# Altium project RIO_rev0.PrjPcb
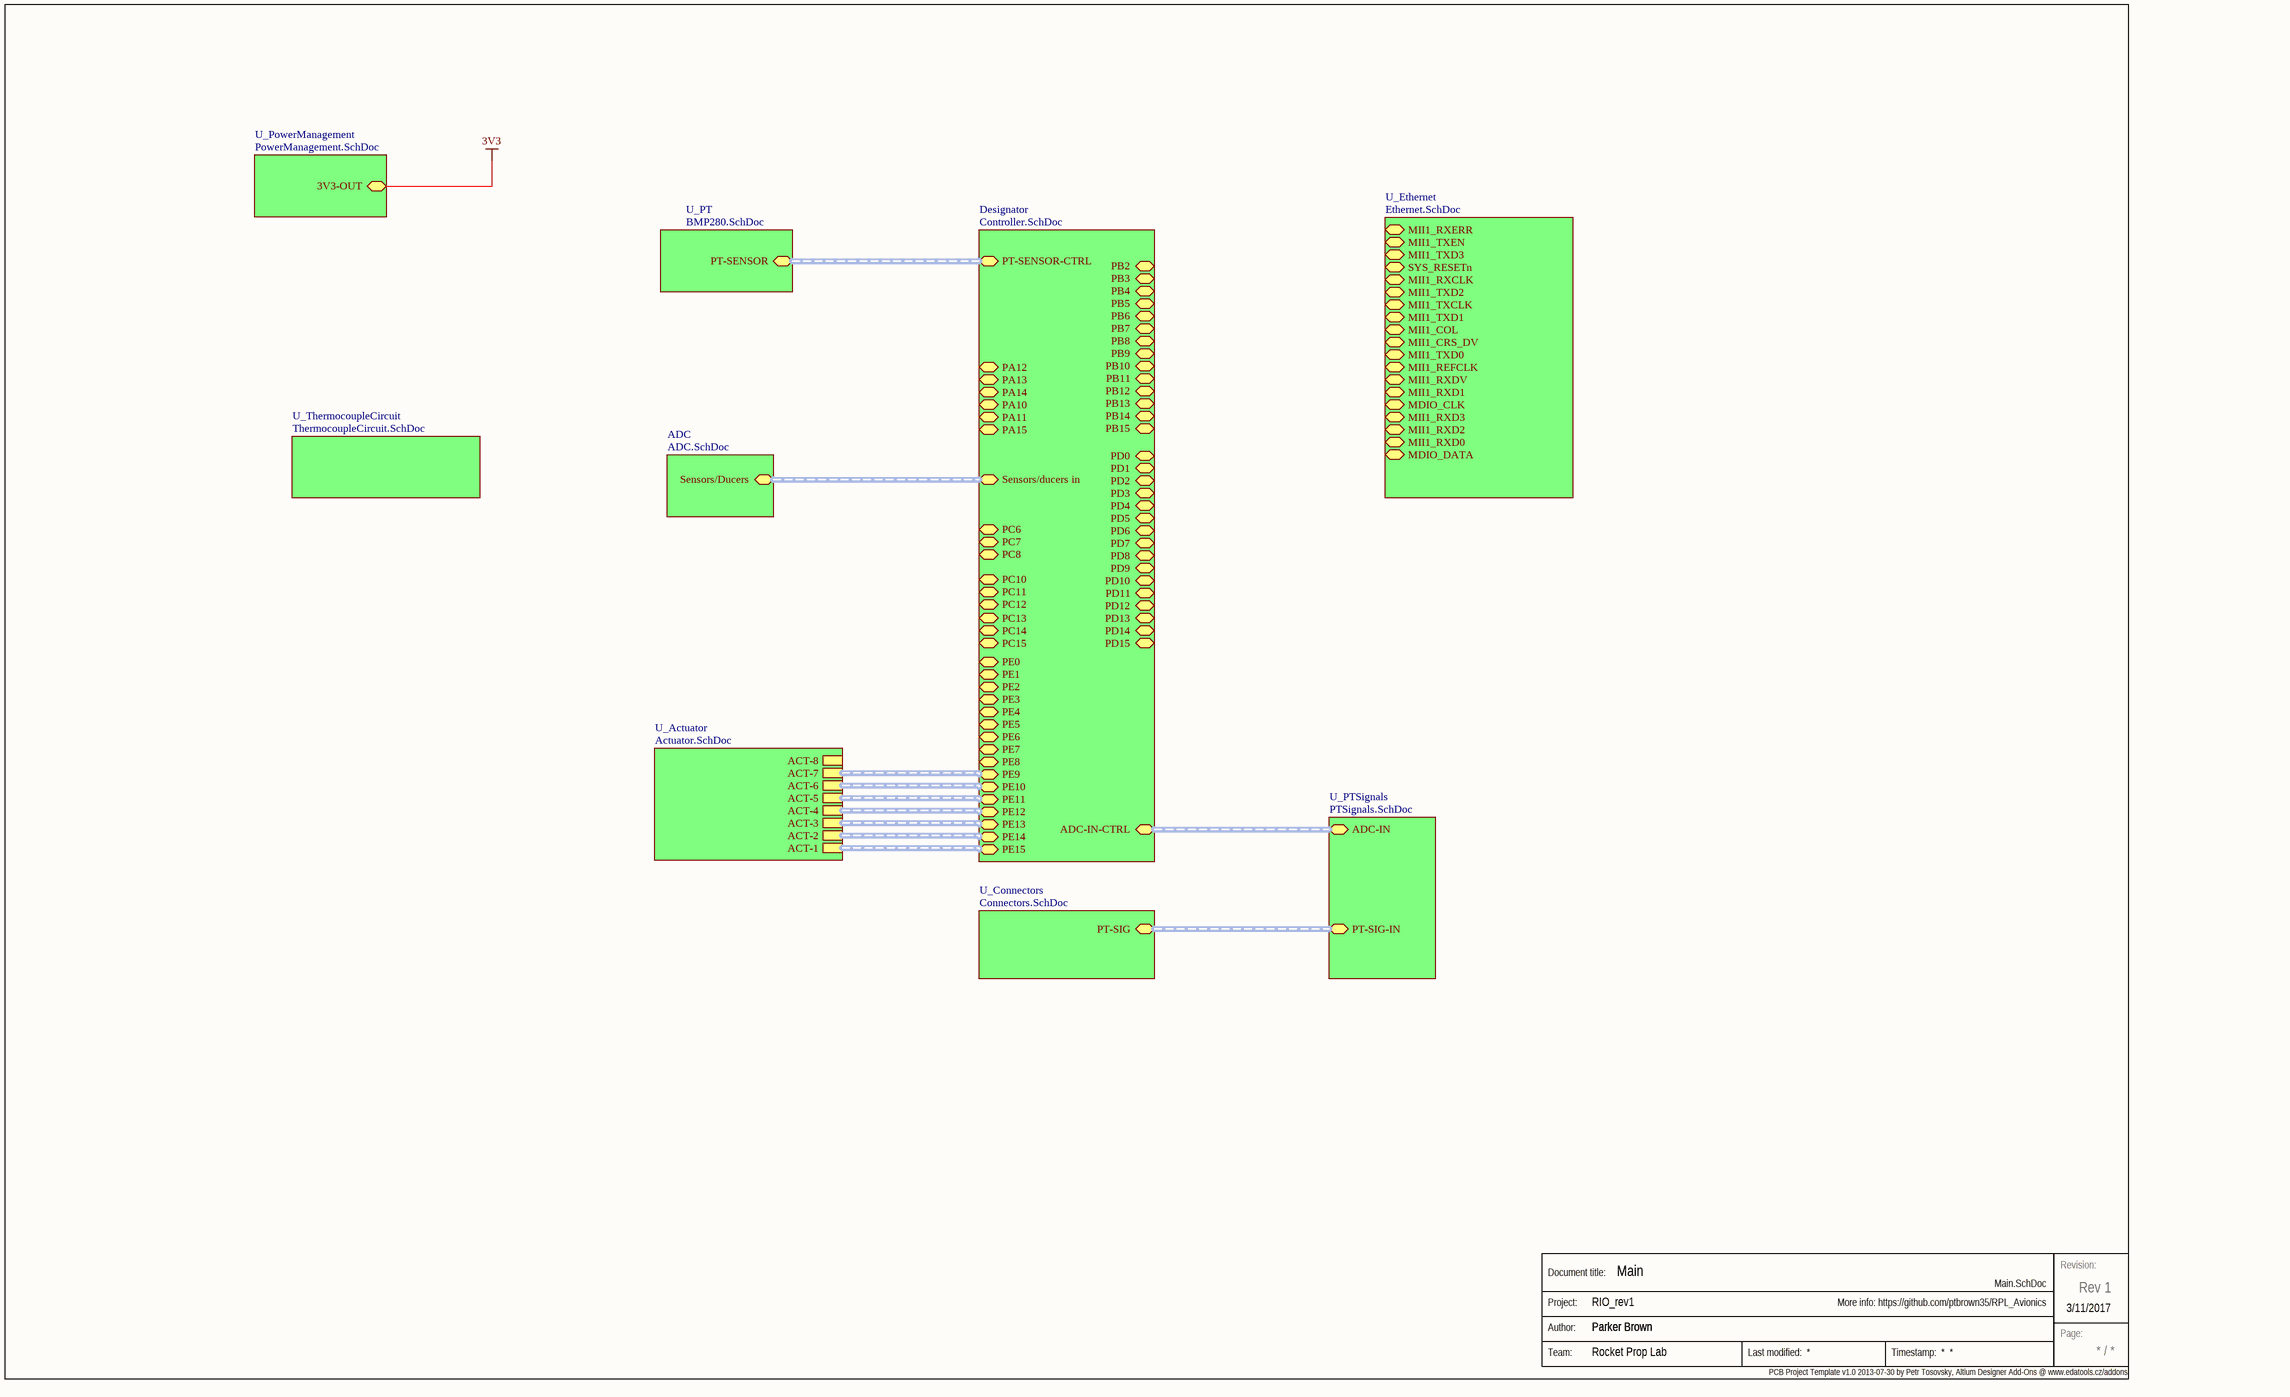
[diagram p0: Main.SchDoc]
GlobalProjectLink: https://github.com/ptbrown35/RPL_Avionics; GlobalProjectName: RIO_rev1; GlobalProjectRevision: Rev 1; GlobalProjectTeam: Rocket Prop Lab; GlobalRevisionDate: 3/11/2017
9 sheets, 86 parts. Net scope: hierarchical (ports join the sheet entries above them; power ports are global).
Board file: RIO_rev0.PcbDoc
Sheets:
  Main.SchDoc
    Designator = Controller.SchDoc
    U_Ethernet = Ethernet.SchDoc
    U_Connectors = Connectors.SchDoc
      J-PT1 = AnalogConnectors.SchDoc
      J-PT2 = AnalogConnectors.SchDoc
      J-PT3 = AnalogConnectors.SchDoc
      J-PT4 = AnalogConnectors.SchDoc
      J-PT5 = AnalogConnectors.SchDoc
      J-PT6 = AnalogConnectors.SchDoc
      J-PT7 = AnalogConnectors.SchDoc
      J-PT8 = AnalogConnectors.SchDoc
    U_PowerManagement = PowerManagement.SchDoc
    U_PTSignals = PTSignals.SchDoc
    U_ThermocoupleCircuit = ThermocoupleCircuit.SchDoc
    U_Actuator = Actuator.SchDoc

## Sheet Main.SchDoc: Main
size Tabloid; Author: Parker Brown

### Parts
(Parts that share a designator on the sheet are numbered #1, #2 ... from top to bottom, then left to right.)
Stamp#1  Stamp  (value not drawn)  (graphical)

### Sub-sheets
ADC = ADC.SchDoc (file not in this document): Sensors/Ducers (harness ADC to micro)
Designator = Controller.SchDoc: PA12, PA13, PA14, PA10, PA11, PA15, PC6, PC7, PC8, PC13, PC14, PC15, PC11, PC12, PC10, PE0, PE1, PE2, PE3, PE4, PE5, PE6, PE7, PE8, PE9, PE10, PE11, PE12, PE13, PE14, PE15, PB2, PB3, PB4, PB5, PB6, PB7, PB8, PB9, PB10, PB11, PB12, PB13, PB14, PB15, PD0, PD1, PD2, PD3, PD4, PD5, PD6, PD7, PD8, PD9, PD10, PD11, PD12, PD13, PD14, PD15, ADC-IN-CTRL (harness ADC), PT-SENSOR-CTRL (harness PT-SENSOR), Sensors/ducers in (harness ADC)
U_Actuator = Actuator.SchDoc: ACT-8 (harness ACT), ACT-7 (harness ACT), ACT-6 (harness ACT), ACT-5 (harness ACT), ACT-4 (harness ACT), ACT-3 (harness ACT), ACT-2 (harness ACT), ACT-1 (harness ACT)
U_Connectors = Connectors.SchDoc: PT-SIG (harness PT-SIGNALS)
U_Ethernet = Ethernet.SchDoc: MII1_RXERR, MII1_TXEN, MII1_TXD3, SYS_RESETn, MII1_RXCLK, MII1_TXD2, MII1_TXCLK, MII1_TXD1, MII1_COL, MII1_CRS_DV, MII1_TXD0, MII1_REFCLK, MII1_RXDV, MII1_RXD1, MDIO_CLK, MII1_RXD3, MII1_RXD2, MII1_RXD0, MDIO_DATA
U_PowerManagement = PowerManagement.SchDoc: 3V3-OUT
U_PT = BMP280.SchDoc (file not in this document): PT-SENSOR (harness PT-SENSOR)
U_PTSignals = PTSignals.SchDoc: PT-SIG-IN (harness PT-SIGNALS), ADC-IN (harness ADC)
U_ThermocoupleCircuit = ThermocoupleCircuit.SchDoc: no entries

### Buses and harness runs
harness sheet ADC/Sensors/Ducers = sheet Designator/Sensors/ducers in
harness sheet Designator/ADC-IN-CTRL = sheet U_PTSignals/ADC-IN
harness sheet Designator/PE9 = sheet U_Actuator/ACT-7
harness sheet Designator/PE10 = sheet U_Actuator/ACT-6
harness sheet Designator/PE11 = sheet U_Actuator/ACT-5
harness sheet Designator/PE12 = sheet U_Actuator/ACT-4
harness sheet Designator/PE13 = sheet U_Actuator/ACT-3
harness sheet Designator/PE14 = sheet U_Actuator/ACT-2
harness sheet Designator/PE15 = sheet U_Actuator/ACT-1
harness sheet Designator/PT-SENSOR-CTRL = sheet U_PT/PT-SENSOR
harness sheet U_Connectors/PT-SIG = sheet U_PTSignals/PT-SIG-IN

### Notes on the sheet
- PCB Project Template v1.0 2013-07-30 by Petr Tosovsky, Altium Designer Add-Ons @ www.edatools.cz/addons <http://www.edatools.cz/addons>
- Labels drawn without touching a wire or pin: 3V3
- (in symbol Stamp) Revision:; Document title:; Project:; Author:; Page:; Team:

## Sheet Controller.SchDoc: Set in Document Options » Parameters » Title
size Tabloid; Author: Set in Document Options » Parameters » Author + Contact info
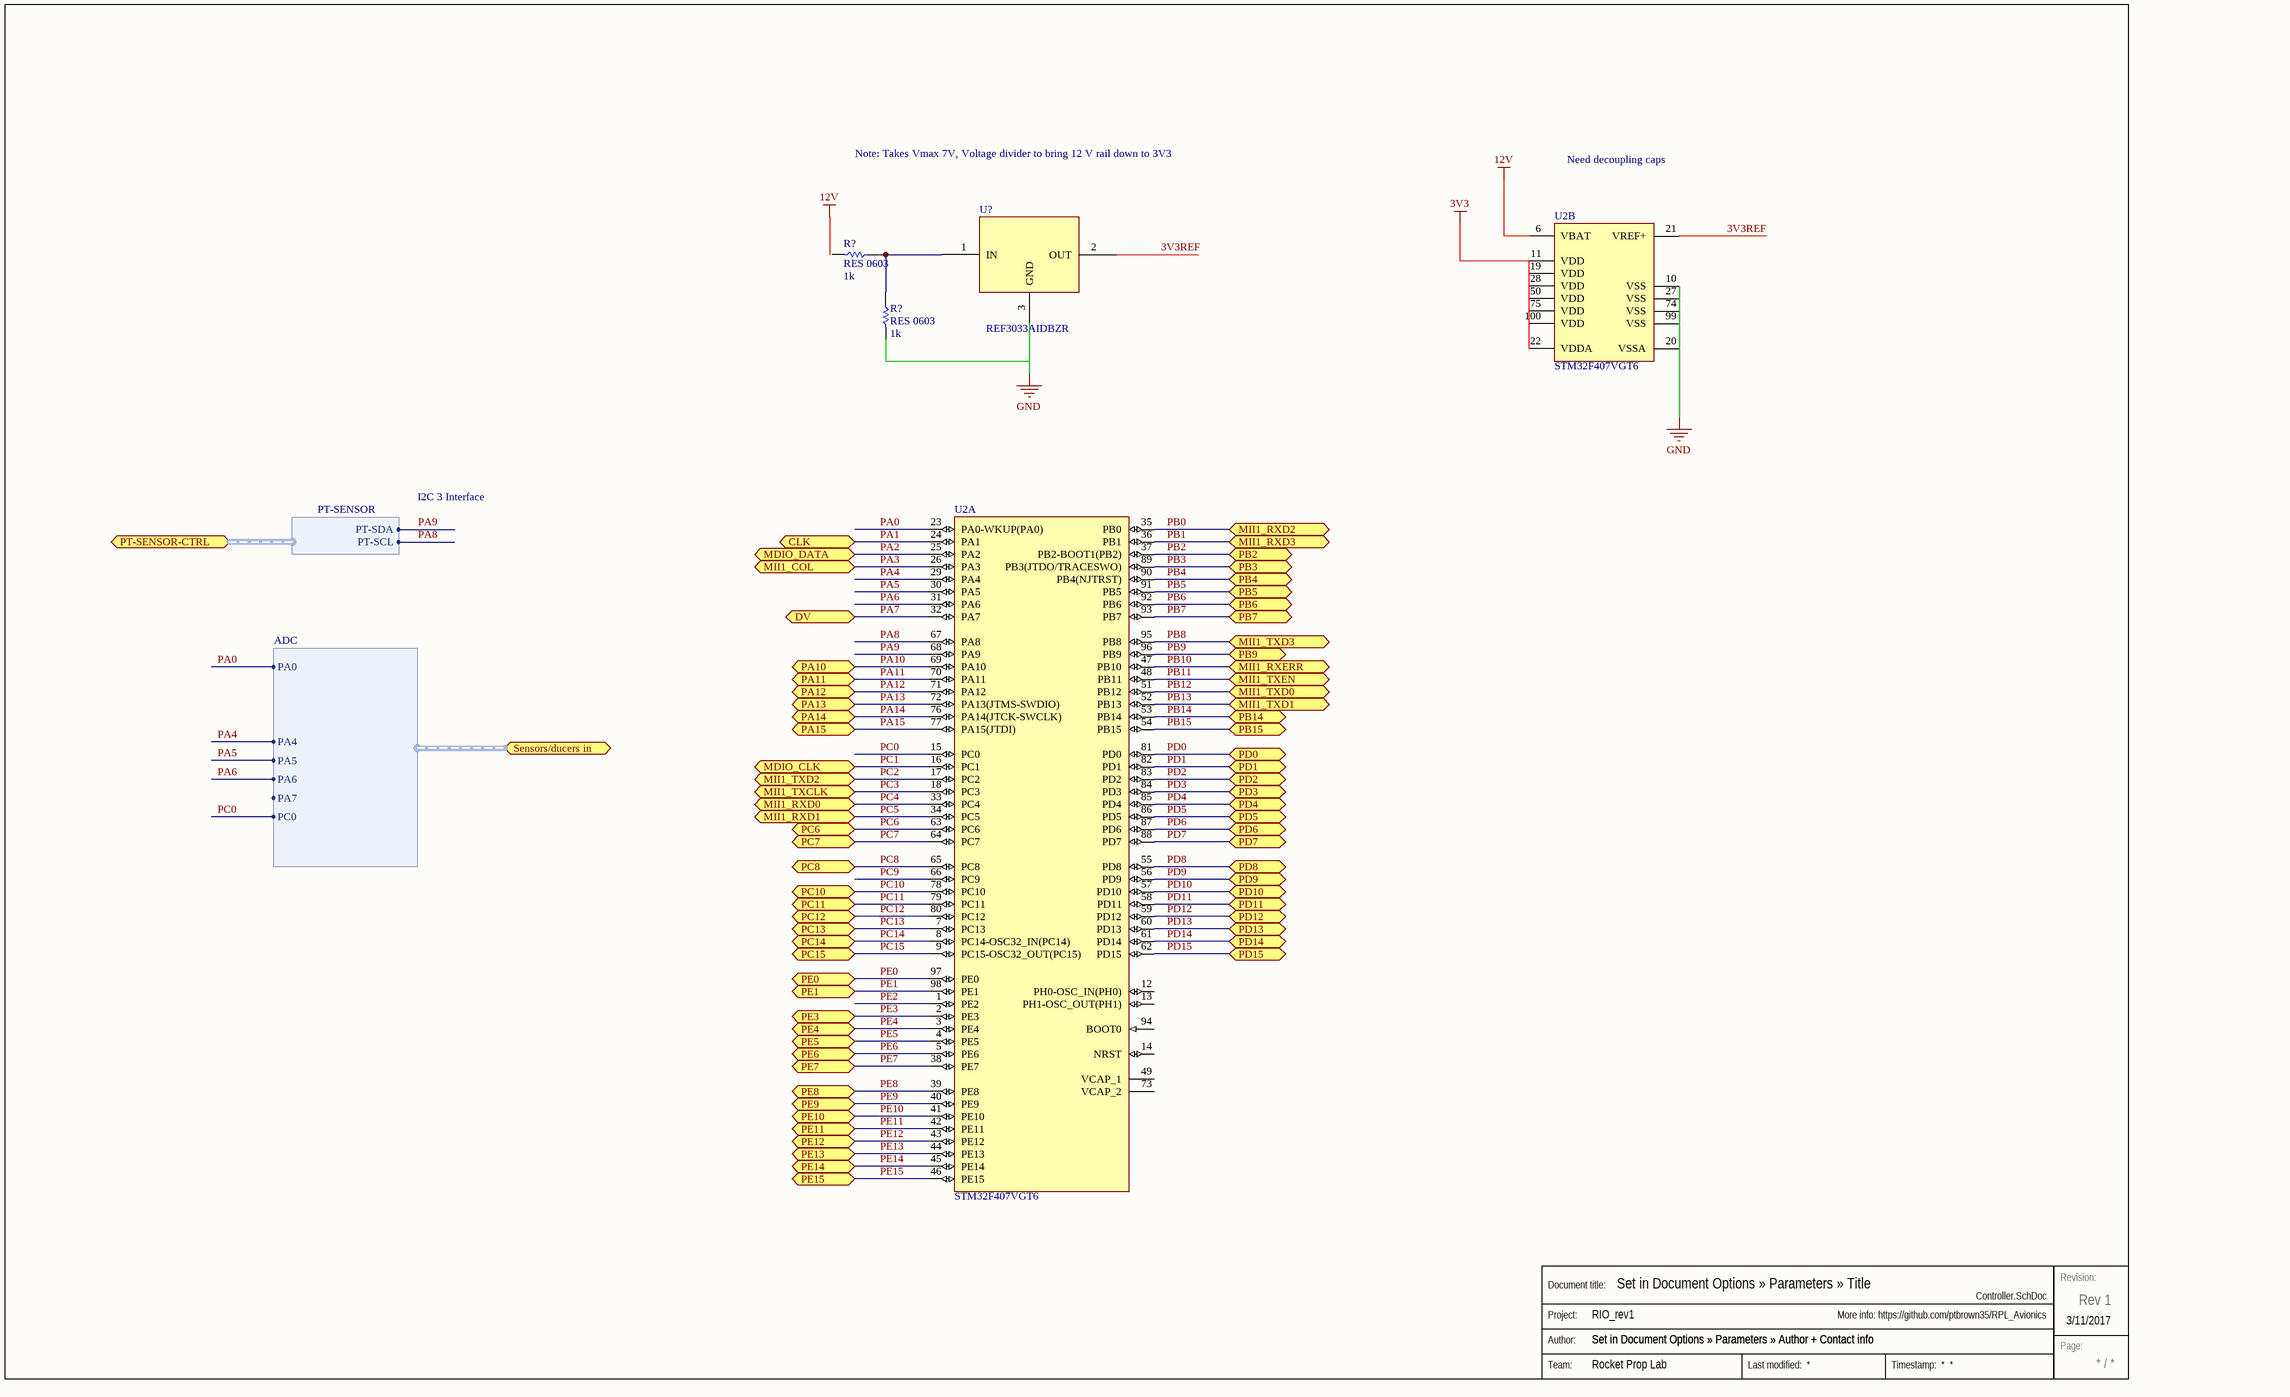
[diagram p1: Controller.SchDoc]

### Parts
(Parts that share a designator on the sheet are numbered #1, #2 ... from top to bottom, then left to right.)
R?#1  RES 0603  Value (Ohms): 1k  [RES 0603]
R?#2  RES 0603  Value (Ohms): 1k  [RES 0603]
Stamp#2  Stamp  (value not drawn)  (graphical)
U2  STM32F407VGT6  [STM-LQFP100_N]  (parts A,B of 2)
U?#1  REF3033AIDBZR  [SOT95P282X145-3N]

### Ports
CLK, DV, MDIO_CLK, MDIO_DATA, MII1_COL, MII1_RXD0, MII1_RXD1, MII1_RXD2, MII1_RXD3, MII1_RXERR, MII1_TXCLK, MII1_TXD0, MII1_TXD1, MII1_TXD2, MII1_TXD3, MII1_TXEN, PA10, PA11, PA12, PA13, PA14, PA15, PB2, PB3, PB4, PB5, PB6, PB7, PB9, PB14, PB15, PC6, PC7, PC8, PC10, PC11, PC12, PC13, PC14, PC15, PD0, PD1, PD2, PD3, PD4, PD5, PD6, PD7, PD8, PD9, PD10, PD11, PD12, PD13, PD14, PD15, PE0, PE1, PE3, PE4, PE5, PE6, PE7, PE8, PE9, PE10, PE11, PE12, PE13, PE14, PE15, PT-SENSOR-CTRL (harness PT-SENSOR), Sensors/ducers in (harness ADC)

### Harnesses
PT-SENSOR: PT-SCL, PT-SDA
ADC: PA0, PA4, PA5, PA6, PA7, PC0

### Nets
PA0: U2.23(PA0-WKUP(PA0)) ; port Sensors/ducers in.PA0
PA1: U2.24(PA1) ; port CLK
PA2: U2.25(PA2) ; port MDIO_DATA
PA3: U2.26(PA3) ; port MII1_COL
PA4: U2.29(PA4) ; port Sensors/ducers in.PA4
PA5: U2.30(PA5) ; port Sensors/ducers in.PA5
PA6: U2.31(PA6) ; port Sensors/ducers in.PA6
PA7: U2.32(PA7) ; port DV
PA8: U2.67(PA8) ; port PT-SENSOR-CTRL.PT-SCL
PA9: U2.68(PA9) ; port PT-SENSOR-CTRL.PT-SDA
PA10: U2.69(PA10) ; port PA10
PA11: U2.70(PA11) ; port PA11
PA12: U2.71(PA12) ; port PA12
PA13: U2.72(PA13(JTMS-SWDIO)) ; port PA13
PA14: U2.76(PA14(JTCK-SWCLK)) ; port PA14
PA15: U2.77(PA15(JTDI)) ; port PA15
PB0: U2.35(PB0) ; port MII1_RXD2
PB1: U2.36(PB1) ; port MII1_RXD3
PB2: U2.37(PB2-BOOT1(PB2)) ; port PB2
PB3: U2.89(PB3(JTDO/TRACESWO)) ; port PB3
PB4: U2.90(PB4(NJTRST)) ; port PB4
PB5: U2.91(PB5) ; port PB5
PB6: U2.92(PB6) ; port PB6
PB7: U2.93(PB7) ; port PB7
PB8: U2.95(PB8) ; port MII1_TXD3
PB9: U2.96(PB9) ; port PB9
PB10: U2.47(PB10) ; port MII1_RXERR
PB11: U2.48(PB11) ; port MII1_TXEN
PB12: U2.51(PB12) ; port MII1_TXD0
PB13: U2.52(PB13) ; port MII1_TXD1
PB14: U2.53(PB14) ; port PB14
PB15: U2.54(PB15) ; port PB15
PC0: U2.15(PC0) ; port Sensors/ducers in.PC0
PC1: U2.16(PC1) ; port MDIO_CLK
PC2: U2.17(PC2) ; port MII1_TXD2
PC3: U2.18(PC3) ; port MII1_TXCLK
PC4: U2.33(PC4) ; port MII1_RXD0
PC5: U2.34(PC5) ; port MII1_RXD1
PC6: U2.63(PC6) ; port PC6
PC7: U2.64(PC7) ; port PC7
PC8: U2.65(PC8) ; port PC8
PC9: U2.66(PC9)
PC10: U2.78(PC10) ; port PC10
PC11: U2.79(PC11) ; port PC11
PC12: U2.80(PC12) ; port PC12
PC13: U2.7(PC13) ; port PC13
PC14: U2.8(PC14-OSC32_IN(PC14)) ; port PC14
PC15: U2.9(PC15-OSC32_OUT(PC15)) ; port PC15
PD0: U2.81(PD0) ; port PD0
PD1: U2.82(PD1) ; port PD1
PD2: U2.83(PD2) ; port PD2
PD3: U2.84(PD3) ; port PD3
PD4: U2.85(PD4) ; port PD4
PD5: U2.86(PD5) ; port PD5
PD6: U2.87(PD6) ; port PD6
PD7: U2.88(PD7) ; port PD7
PD8: U2.55(PD8) ; port PD8
PD9: U2.56(PD9) ; port PD9
PD10: U2.57(PD10) ; port PD10
PD11: U2.58(PD11) ; port PD11
PD12: U2.59(PD12) ; port PD12
PD13: U2.60(PD13) ; port PD13
PD14: U2.61(PD14) ; port PD14
PD15: U2.62(PD15) ; port PD15
PE0: U2.97(PE0) ; port PE0
PE1: U2.98(PE1) ; port PE1
PE2: U2.1(PE2)
PE3: U2.2(PE3) ; port PE3
PE4: U2.3(PE4) ; port PE4
PE5: U2.4(PE5) ; port PE5
PE6: U2.5(PE6) ; port PE6
PE7: U2.38(PE7) ; port PE7
PE8: U2.39(PE8) ; port PE8
PE9: U2.40(PE9) ; port PE9
PE10: U2.41(PE10) ; port PE10
PE11: U2.42(PE11) ; port PE11
PE12: U2.43(PE12) ; port PE12
PE13: U2.44(PE13) ; port PE13
PE14: U2.45(PE14) ; port PE14
PE15: U2.46(PE15) ; port PE15
NetR?#1_2: R?#1.2 R?#2.2 U?#1.1(IN)

Not connected (* = marked no-connect by the designer): R?#1 1; R?#2 1; U2 6(VBAT) 10(VSS) 11(VDD) 12(PH0-OSC_IN(PH0)) 13(PH1-OSC_OUT(PH1)) 14(NRST) 19(VDD) 20(VSSA) 21(VREF+) 22(VDDA) 27(VSS) 28(VDD) 49(VCAP_1) 50(VDD) 73(VCAP_2) 74(VSS) 75(VDD) 94(BOOT0) 99(VSS) 100(VDD); U?#1 2(OUT) 3(GND)

### Buses and harness runs
bus 3V3REF

### Notes on the sheet
- Note: Takes Vmax 7V, Voltage divider to bring 12 V rail down to 3V3
- Need decoupling caps
- I2C 3 Interface
- Labels drawn without touching a wire or pin: 3V3, 12V, GND
- (in symbol Stamp) Revision:; Document title:; Project:; Author:; Page:; Team:

### Library data of the parts
U2 = STM32F407VGT6: ARM Cortex-M4 32-bit MCU+FPU, 210 DMIPS, 1024 kB Flash, 192 kB Internal RAM, 82 I/Os, 100-pin LQFP, -40 to 85 degC, Tray; Manufacturer: STMicroelectronics; D/A Converter: 2x12-bit; FLASH Size (Prog) (kB): 1024; I/Os (High Current): 82; Internal RAM Size (kB): 192; Operating Frequency(F) (Processor speed) (MHz): 168; Supply Voltage(Vcc) max (V): 3.6; Supply Voltage(Vcc) min (V): 1.8; DatasheetVersion: Rev. 4; PackageVersion: Rev. 1, 06/2013; PackageReference: LQFP100; PackageDescription: 100-Pin Low Profile Quad Flat Package, 14 x 14 mm Body, 0.5 mm Pitch; Supplier 1: Digi-Key; Supplier Part Number 1: 497-11605-ND; Supplier 2: Farnell; Supplier Part Number 2: 2064368; Supplier 3: Newark; Supplier Part Number 3: 73T2333; Supplier 4: Mouser; Supplier Part Number 4: 511-STM32F407VGT6; Core: ARM Cortex-M4; Packing: Tray; Mounting Technology: Surface Mount; PartNumber: STM32F407VGT6; ComponentLink1Description: Manufacturer URL; ComponentLink1URL: http://www.st.com/web/en/home.html; ComponentLink2Description: Datasheet; ComponentLink2URL: http://www.st.com/st-web-ui/static/active/en/resource/technical/document/datasheet/DM00037051.pdf; ComponentLink3Description: Package Specification; ComponentLink3URL: http://www.st.com/st-web-ui/static/active/en/resource/technical/document/data_brief/DM00071938.pdf
U?#1 = REF3033AIDBZR: Manufacturer: Texas Instrument; Digikey Link: https://www.digikey.com/product-detail/en/texas-instruments/REF3033AIDBZR/296-26324-1-ND/2254967; Digikey P/N: 296-26324-1-ND; Manufacturer P/N: REF3033AIDBZR
R?#1 R?#2 = RES 0603: PartNumber: *; Tolerance: *

## Sheet Ethernet.SchDoc: RIO: ETHERNET
size Tabloid; Author: Set in Document Options » Parameters » Author + Contact info
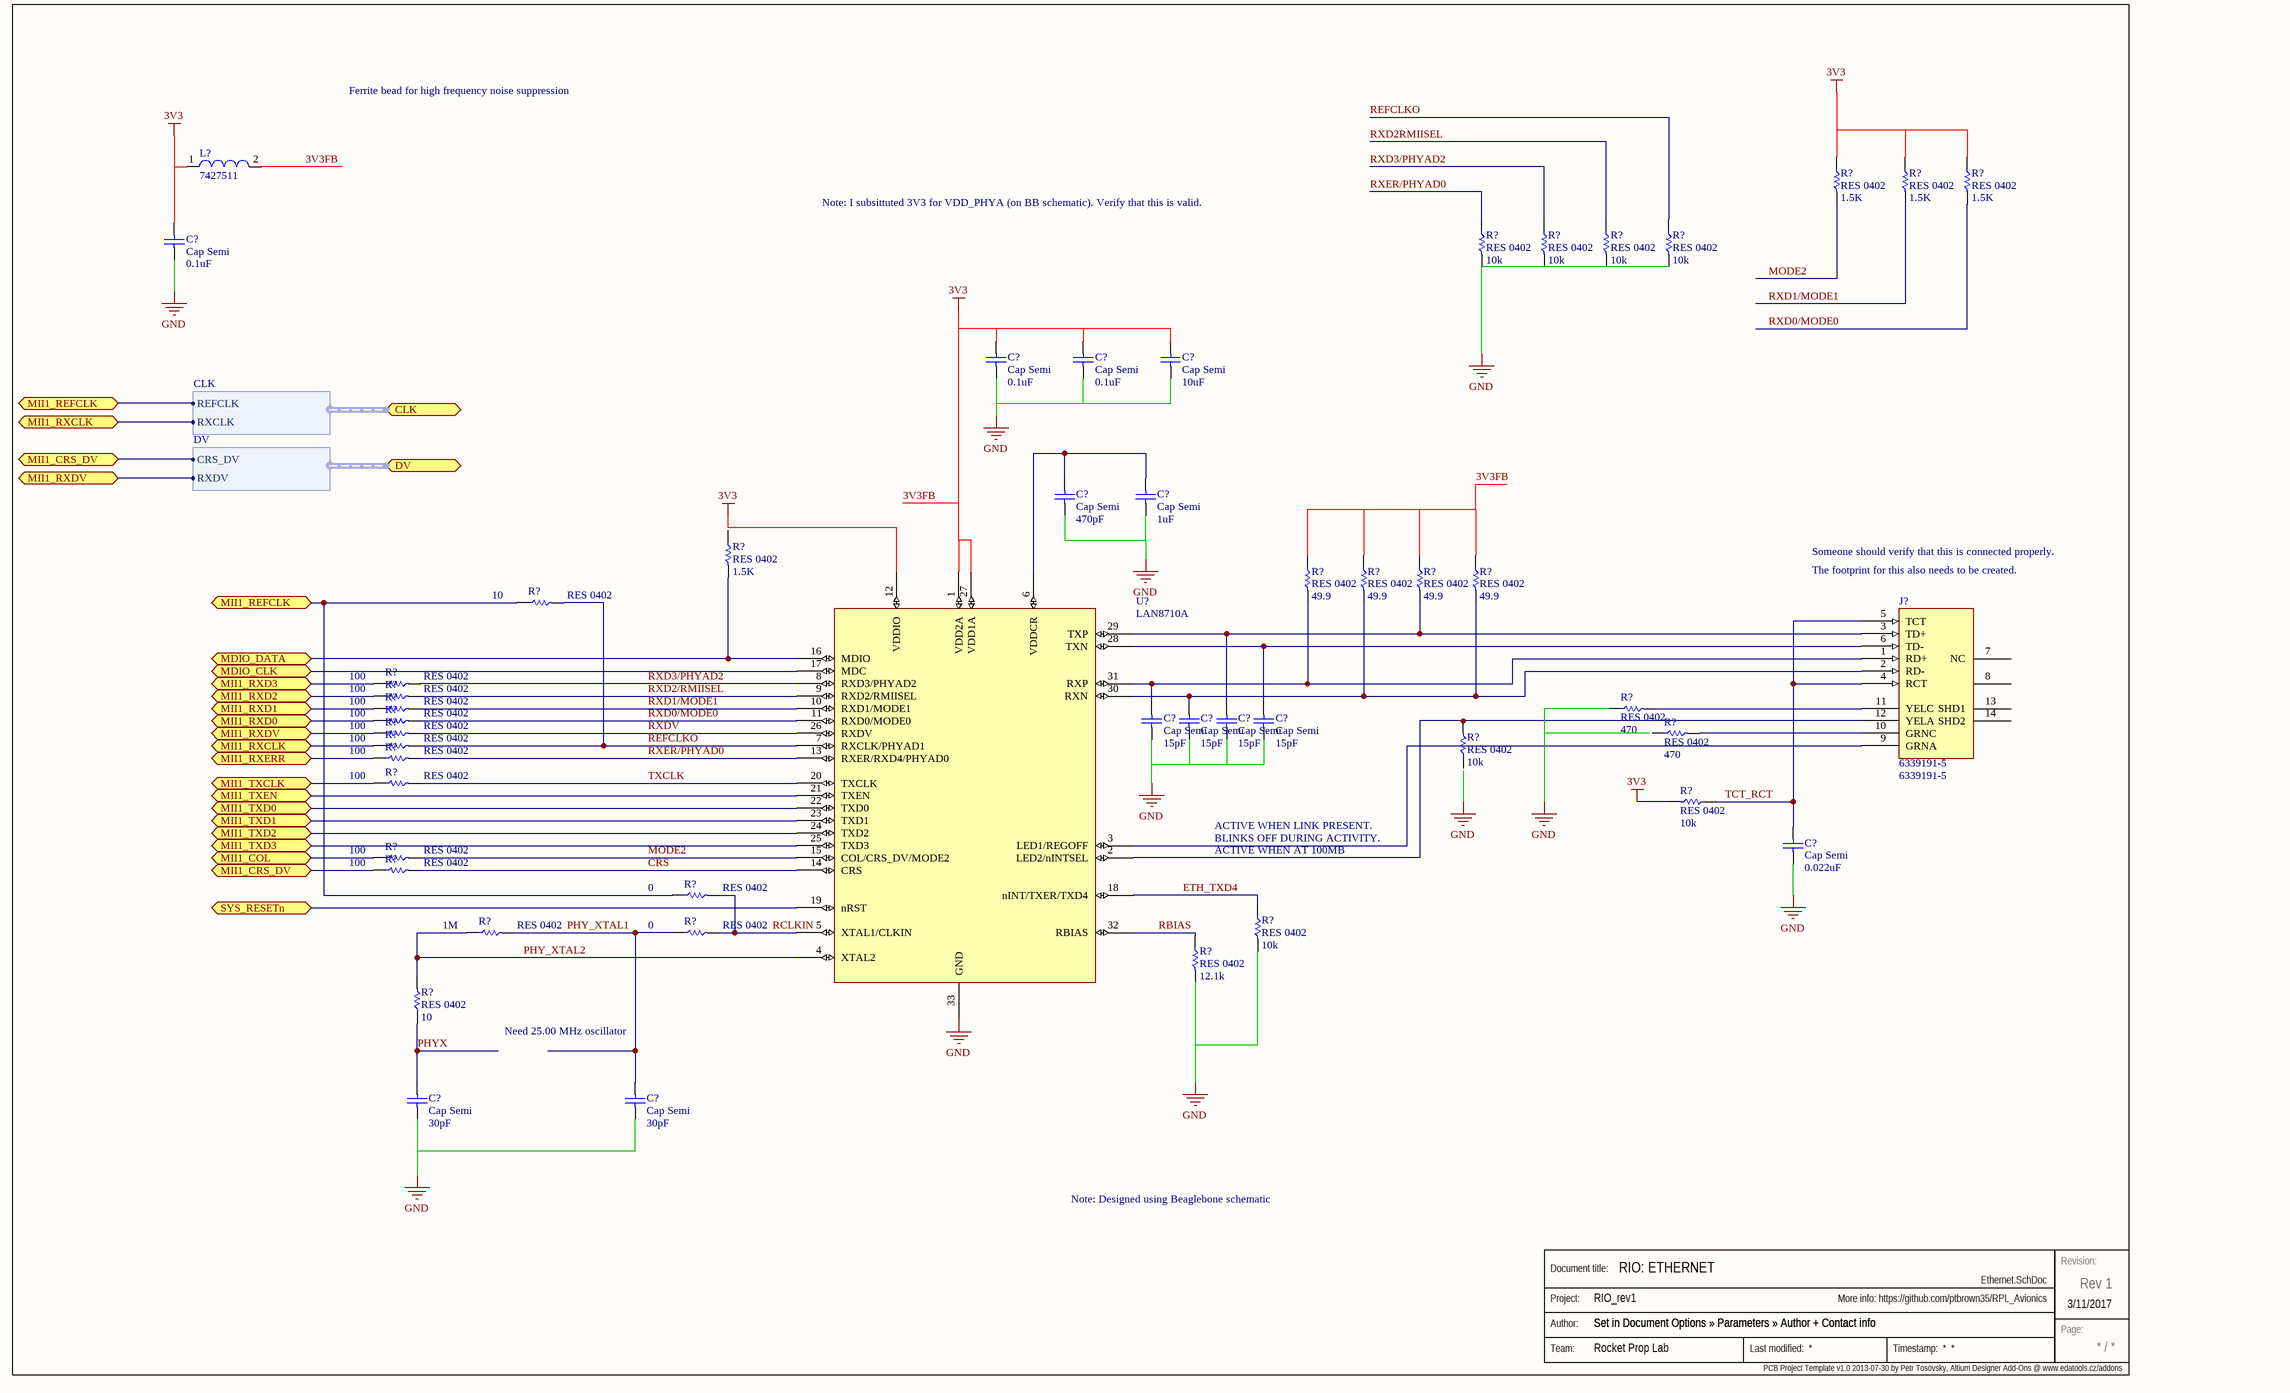
[diagram p2: Ethernet.SchDoc]

### Parts
(Parts that share a designator on the sheet are numbered #1, #2 ... from top to bottom, then left to right.)
C?#1  Cap Semi  value 0.1uF  [0402]
C?#2  Cap Semi  value 0.1uF  [0402]
C?#3  Cap Semi  value 0.1uF  [0402]
C?#4  Cap Semi  value 10uF  [0402]
C?#5  Cap Semi  value 470pF  [0402]
C?#6  Cap Semi  value 1uF  [0402]
C?#7  Cap Semi  value 15pF  [0402]
C?#8  Cap Semi  value 15pF  [0402]
C?#9  Cap Semi  value 15pF  [0402]
C?#10  Cap Semi  value 15pF  [0402]
C?#11  Cap Semi  value 0.022uF  [0402]
C?#12  Cap Semi  value 30pF  [0402]
C?#13  Cap Semi  value 30pF  [0402]
J?#1  6339191-5  [Ethernet connector]
L?  7427511  [WE-SUKW-7427511]
R?#3  RES 0402  Value (Ohms): 1.5K  [RES 0402]
R?#4  RES 0402  Value (Ohms): 1.5K  [RES 0402]
R?#5  RES 0402  Value (Ohms): 1.5K  [RES 0402]
R?#6  RES 0402  Value (Ohms): 10k  [RES 0402]
R?#7  RES 0402  Value (Ohms): 10k  [RES 0402]
R?#8  RES 0402  Value (Ohms): 10k  [RES 0402]
R?#9  RES 0402  Value (Ohms): 10k  [RES 0402]
R?#10  RES 0402  Value (Ohms): 1.5K  [RES 0402]
R?#11  RES 0402  Value (Ohms): 10  [RES 0402]
R?#12  RES 0402  Value (Ohms): 49.9  [RES 0402]
R?#13  RES 0402  Value (Ohms): 49.9  [RES 0402]
R?#14  RES 0402  Value (Ohms): 49.9  [RES 0402]
R?#15  RES 0402  Value (Ohms): 49.9  [RES 0402]
R?#16  RES 0402  Value (Ohms): 100  [RES 0402]
R?#17  RES 0402  Value (Ohms): 100  [RES 0402]
R?#18  RES 0402  Value (Ohms): 100  [RES 0402]
R?#19  RES 0402  Value (Ohms): 470  [RES 0402]
R?#20  RES 0402  Value (Ohms): 100  [RES 0402]
R?#21  RES 0402  Value (Ohms): 10k  [RES 0402]
R?#22  RES 0402  Value (Ohms): 100  [RES 0402]
R?#23  RES 0402  Value (Ohms): 470  [RES 0402]
R?#24  RES 0402  Value (Ohms): 100  [RES 0402]
R?#25  RES 0402  Value (Ohms): 100  [RES 0402]
R?#26  RES 0402  Value (Ohms): 100  [RES 0402]
R?#27  RES 0402  Value (Ohms): 10k  [RES 0402]
R?#28  RES 0402  Value (Ohms): 100  [RES 0402]
R?#29  RES 0402  Value (Ohms): 100  [RES 0402]
R?#30  RES 0402  Value (Ohms): 0  [RES 0402]
R?#31  RES 0402  Value (Ohms): 1M  [RES 0402]
R?#32  RES 0402  Value (Ohms): 0  [RES 0402]
R?#33  RES 0402  Value (Ohms): 10k  [RES 0402]
R?#34  RES 0402  Value (Ohms): 10  [RES 0402]
R?#35  RES 0402  Value (Ohms): 12.1k  [RES 0402]
Stamp#3  Stamp  (value not drawn)  (graphical)
U?#2  LAN8710A  [QFN-32_UH-L]

### Ports
CLK (harness CLK), DV (harness DV), MDIO_CLK, MDIO_DATA, MII1_COL, MII1_CRS_DV, MII1_REFCLK, MII1_RXCLK, MII1_RXD0, MII1_RXD1, MII1_RXD2, MII1_RXD3, MII1_RXDV, MII1_RXERR, MII1_TXCLK, MII1_TXD0, MII1_TXD1, MII1_TXD2, MII1_TXD3, MII1_TXEN, SYS_RESETn

### Harnesses
CLK: REFCLK, RXCLK
DV: CRS_DV, RXDV

### Nets
3V3: R?#27.1  [project net PT-VCC]
GND: U?#2.33(GND)
CRS: R?#29.1 U?#2.14(CRS)
ETH_TXD4: R?#33.2 U?#2.18(nINT/TXER/TXD4)
MODE2: R?#3.1 R?#28.1 U?#2.15(COL/CRS_DV/MODE2)
PHY_XTAL1: C?#13.2 R?#31.1 R?#32.2
PHY_XTAL2: R?#31.2 R?#34.1 U?#2.4(XTAL2)
PHYX: C?#12.2 R?#34.2
RBIAS: R?#35.2 U?#2.32(RBIAS)
RCLKIN: R?#30.1 R?#32.1 U?#2.5(XTAL1/CLKIN)
REFCLKO: R?#9.2 R?#11.1 R?#24.1 U?#2.7(RXCLK/PHYAD1)
RXD0/MODE0: R?#5.1 R?#20.1 U?#2.11(RXD0/MODE0)
RXD1/MODE1: R?#4.1 R?#18.1 U?#2.10(RXD1/MODE1)
RXD2/RMIISEL: R?#17.1 U?#2.9(RXD2/RMIISEL)
RXD2RMIISEL: R?#8.2
RXD3/PHYAD2: R?#7.2 R?#16.1 U?#2.8(RXD3/PHYAD2)
RXDV: R?#22.1 U?#2.26(RXDV)
RXER/PHYAD0: R?#6.2 R?#25.1 U?#2.13(RXER/RXD4/PHYAD0)
TCT_RCT: C?#11.2 J?#1.4(RCT) J?#1.5(TCT) R?#27.2
TXCLK: R?#26.1 U?#2.20(TXCLK)
NetC?#5_2: C?#5.2 C?#6.2 U?#2.6(VDDCR)
NetC?#7_2: C?#7.2 J?#1.1(RD+) R?#12.1 U?#2.31(RXP)
NetC?#8_2: C?#8.2 J?#1.2(RD-) R?#13.1 R?#15.1 U?#2.30(RXN)
NetC?#9_2: C?#9.2 J?#1.3(TD+) R?#14.1 U?#2.29(TXP)
NetC?#10_2: C?#10.2 J?#1.6(TD-) U?#2.28(TXN)
NetJ?#1_9: J?#1.9(GRNA) U?#2.3(LED1/REGOFF)
NetJ?#1_10: J?#1.10(GRNC) R?#23.1
NetJ?#1_11: J?#1.11(YELC) R?#19.1
NetJ?#1_12: J?#1.12(YELA) R?#21.1 U?#2.2(LED2/nINTSEL)
NetR?#10_1: R?#10.1 U?#2.16(MDIO) ; port MDIO_DATA
NetR?#11_2: R?#11.2 R?#30.2 ; port MII1_REFCLK, port CLK.REFCLK
NetR?#16_2: R?#16.2 ; port MII1_RXD3
NetR?#17_2: R?#17.2 ; port MII1_RXD2
NetR?#18_2: R?#18.2 ; port MII1_RXD1
NetR?#20_2: R?#20.2 ; port MII1_RXD0
NetR?#22_2: R?#22.2 ; port MII1_RXDV, port DV.RXDV
NetR?#24_2: R?#24.2 ; port MII1_RXCLK, port CLK.RXCLK
NetR?#25_2: R?#25.2 ; port MII1_RXERR
NetR?#26_2: R?#26.2 ; port MII1_TXCLK
NetR?#28_2: R?#28.2 ; port MII1_COL
NetR?#29_2: R?#29.2 ; port MII1_CRS_DV, port DV.CRS_DV
NetU?#2_17: U?#2.17(MDC) ; port MDIO_CLK
NetU?#2_19: U?#2.19(nRST) ; port SYS_RESETn
NetU?#2_21: U?#2.21(TXEN) ; port MII1_TXEN
NetU?#2_22: U?#2.22(TXD0) ; port MII1_TXD0
NetU?#2_23: U?#2.23(TXD1) ; port MII1_TXD1
NetU?#2_24: U?#2.24(TXD2) ; port MII1_TXD2
NetU?#2_25: U?#2.25(TXD3) ; port MII1_TXD3

Not connected (* = marked no-connect by the designer): C?#1 1 2; C?#2 1 2; C?#3 1 2; C?#4 1 2; C?#5 1; C?#6 1; C?#7 1; C?#8 1; C?#9 1; C?#10 1; C?#11 1; C?#12 1; C?#13 1; J?#1 7(NC) 8 13(SHD1) 14(SHD2); L? 1 2; R?#3 2; R?#4 2; R?#5 2; R?#6 1; R?#7 1; R?#8 1; R?#9 1; R?#10 2; R?#12 2; R?#13 2; R?#14 2; R?#15 2; R?#19 2; R?#21 2; R?#23 2; R?#33 1; R?#35 1; U?#2 1(VDD2A) 12(VDDIO) 27(VDD1A)

### Buses and harness runs
bus 3V3FB

### Notes on the sheet
- Ferrite bead for high frequency noise suppression
- Note: I subsittuted 3V3 for VDD_PHYA (on BB schematic). Verify that this is valid.
- Someone should verify that this is connected properly.
- (near J?#1) The footprint for this also needs to be created.
- ACTIVE WHEN LINK PRESENT.
- ACTIVE WHEN AT 100MB
- BLINKS OFF DURING ACTIVITY.
- Need 25.00 MHz oscillator
- Note: Designed using Beaglebone schematic
- PCB Project Template v1.0 2013-07-30 by Petr Tosovsky, Altium Designer Add-Ons @ www.edatools.cz/addons <http://www.edatools.cz/addons>
- Labels drawn without touching a wire or pin: 3V3, GND
- (in symbol Stamp) Revision:; Document title:; Project:; Author:; Page:; Team:

### Library data of the parts
C?#1-C?#13 = Cap Semi: Capacitor (Semiconductor SIM Model); Published: 8-Jun-2000; LatestRevisionDate: 29-May-2009; LatestRevisionNote: IPC-7351 Footprint Added.; PackageReference: C1206; Publisher: Altium Limited; PackageDescription: Chip Capacitor
J?#1 = 6339191-5: Ethernet Port; Manufacturer: TE Connectivity AMP Connectors; Digikey Link: https://www.digikey.com/product-detail/en/te-connectivity-amp-connectors/6339191-5/A109166CT-ND/4030384; Digikey P/N: A109166CT-ND; Manufacturer P/N: 6339191-5
L? = 7427511: EMI Suppression 5-Hole Ferrite Bead WE-SUKW, Z = 416 Ohm; Impedance: 416 Ohm; DatasheetVersion: ver 6, Jun - 2007; PackageReference: WE-SUKW-7427511; PackageDescription: Inductor, 2-Leads, Body 5.5 x 5.0 mm; PartNumber: 7427511; ComponentLink1Description: Manufacturer URL; ComponentLink1URL: http://www.we-online.com; ComponentLink2Description: Datasheet; ComponentLink2URL: http://www.we-online.de/katalog/media/pdf/7427511.pdf
U?#2 = LAN8710A: Manufacturer: Microchip Technology; Digikey P/N: LAN8710AI-EZK-TR-ND; Footprint: QFC-32; Digikey Link: https://www.digikey.com/product-detail/en/microchip-technology/LAN8710AI-EZK-TR/LAN8710AI-EZK-TR-ND/3872108; Manufacturer P/N: LAN8710A
R?#3-R?#35 = RES 0402: PartNumber: *; Tolerance: *

## Sheet Connectors.SchDoc: Set in Document Options » Parameters » Title
size Tabloid; Author: Set in Document Options » Parameters » Author + Contact info
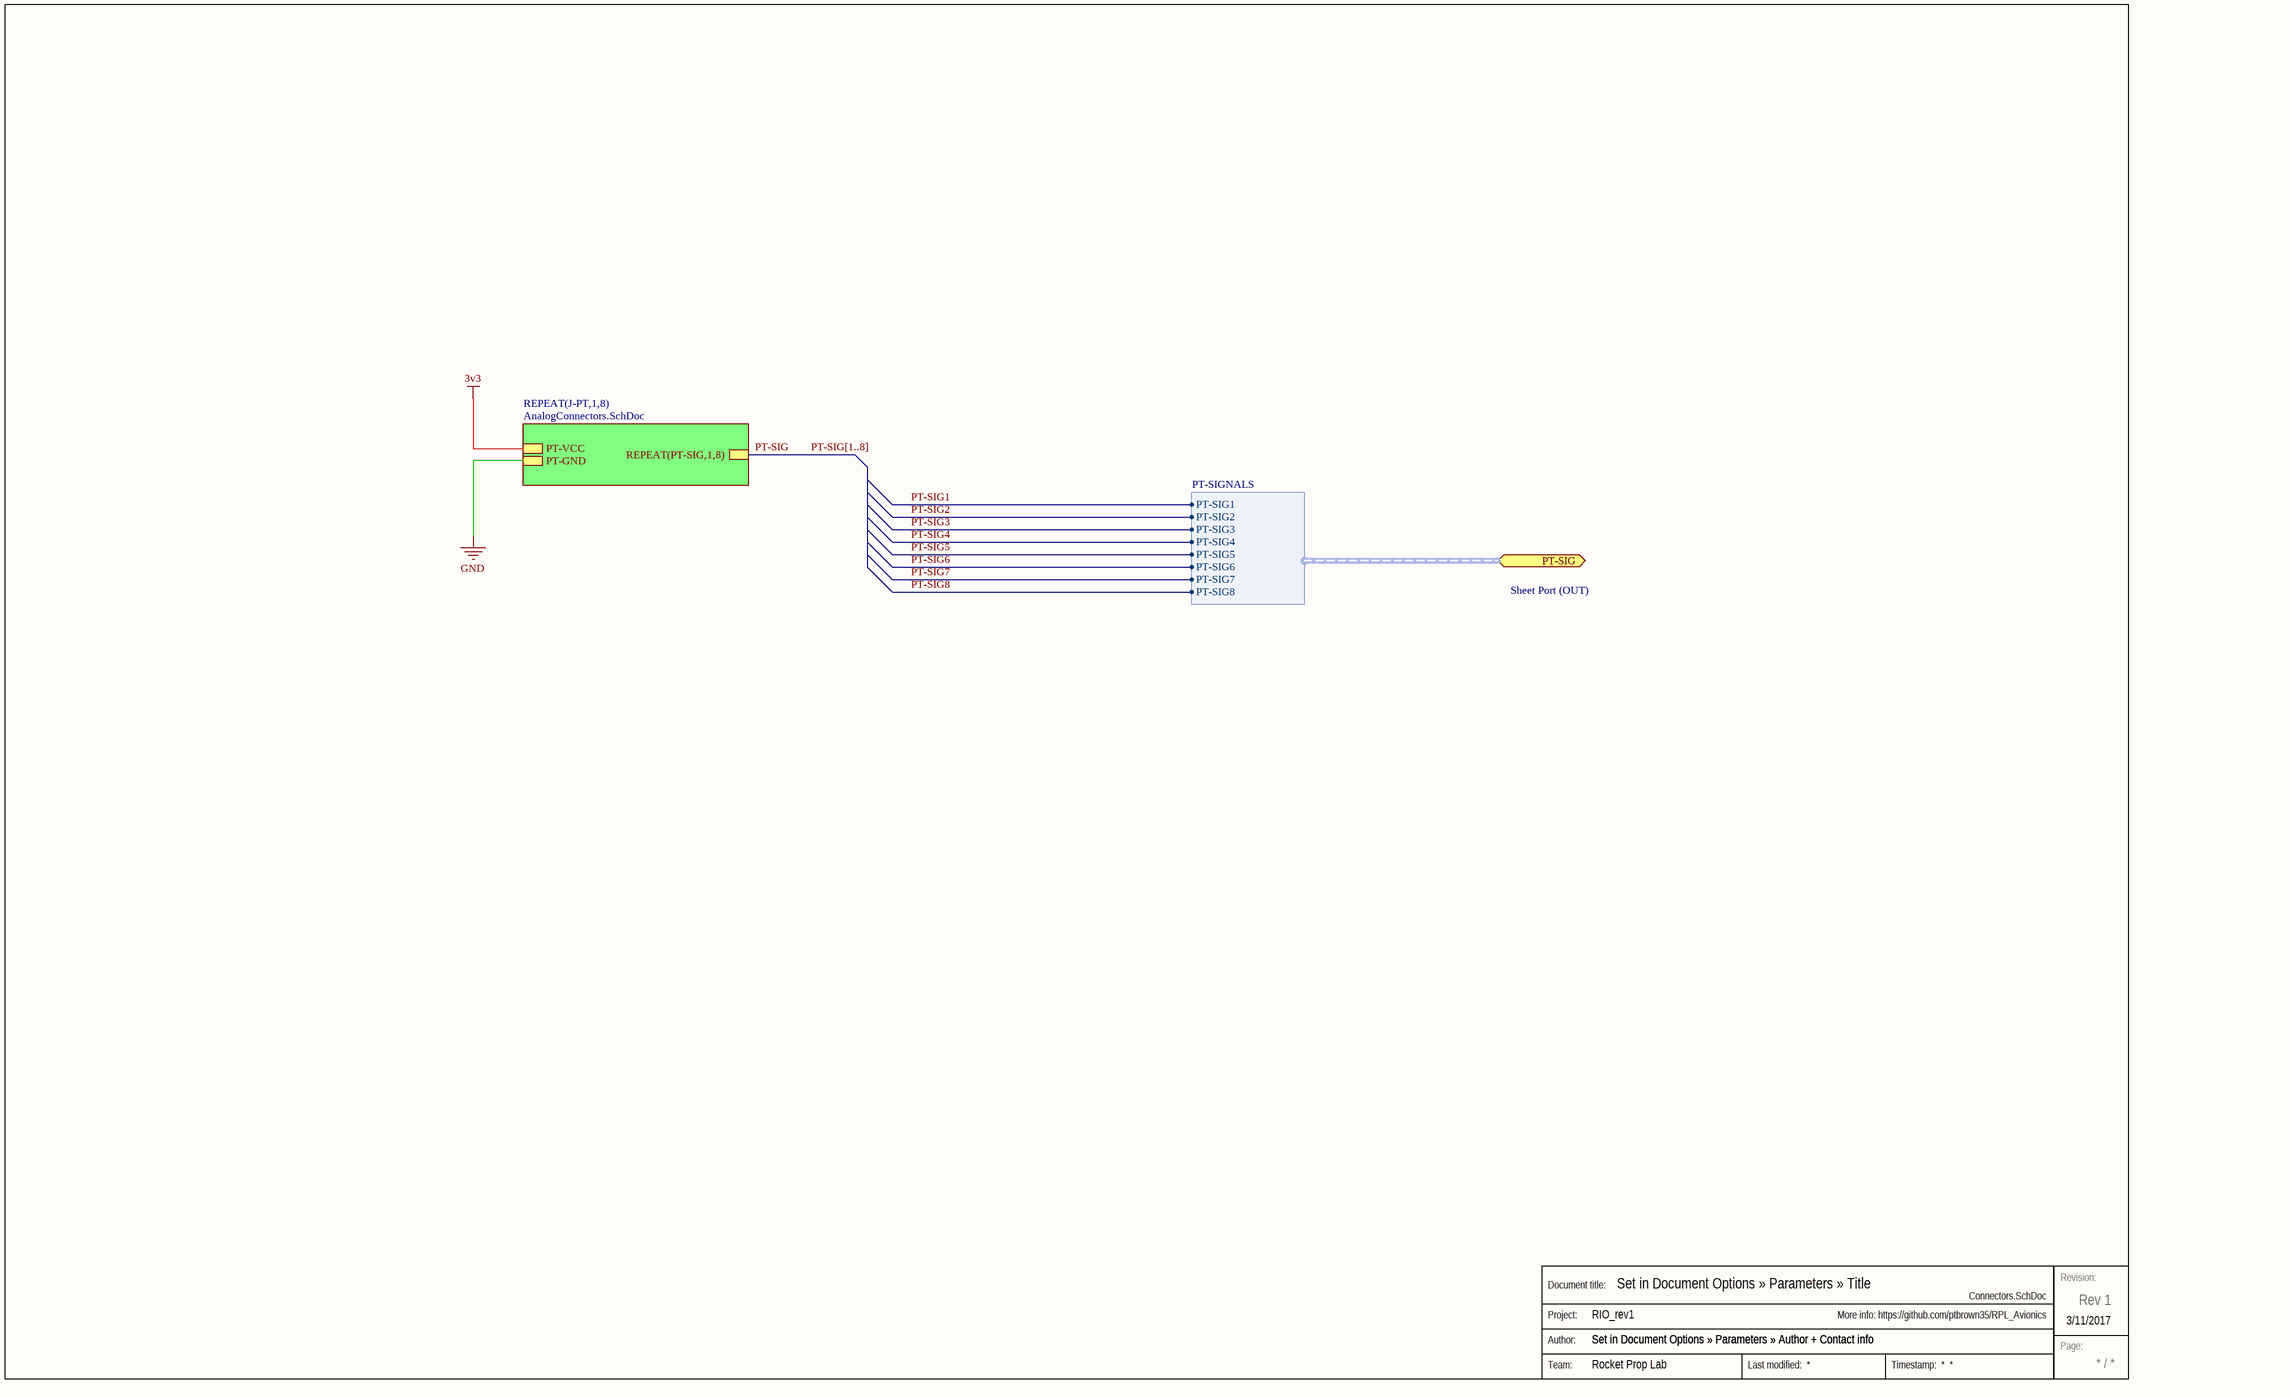
[diagram p3: Connectors.SchDoc]

### Parts
(Parts that share a designator on the sheet are numbered #1, #2 ... from top to bottom, then left to right.)
Stamp#4  Stamp  (value not drawn)  (graphical)

### Sub-sheets
REPEAT(J-PT,1,8) = AnalogConnectors.SchDoc: PT-VCC, REPEAT(PT-SIG,1,8), PT-GND

### Ports
PT-SIG (harness PT-SIGNALS)

### Harnesses
PT-SIGNALS: PT-SIG1, PT-SIG2, PT-SIG3, PT-SIG4, PT-SIG5, PT-SIG6, PT-SIG7, PT-SIG8

### Buses and harness runs
bus PT-SIG[1..8]

### Notes on the sheet
- Sheet Port (OUT)
- (in symbol Stamp) Revision:; Document title:; Project:; Author:; Page:; Team:

## Sheet AnalogConnectors.SchDoc: Set in Document Options » Parameters » Title
size Tabloid; Author: Set in Document Options » Parameters » Author + Contact info
Used 8 times, as channels U_Connectors/J-PT1, U_Connectors/J-PT2, U_Connectors/J-PT3, U_Connectors/J-PT4, U_Connectors/J-PT5, U_Connectors/J-PT6, U_Connectors/J-PT7, U_Connectors/J-PT8. Parts and nets are listed once, with the designators drawn on the sheet.
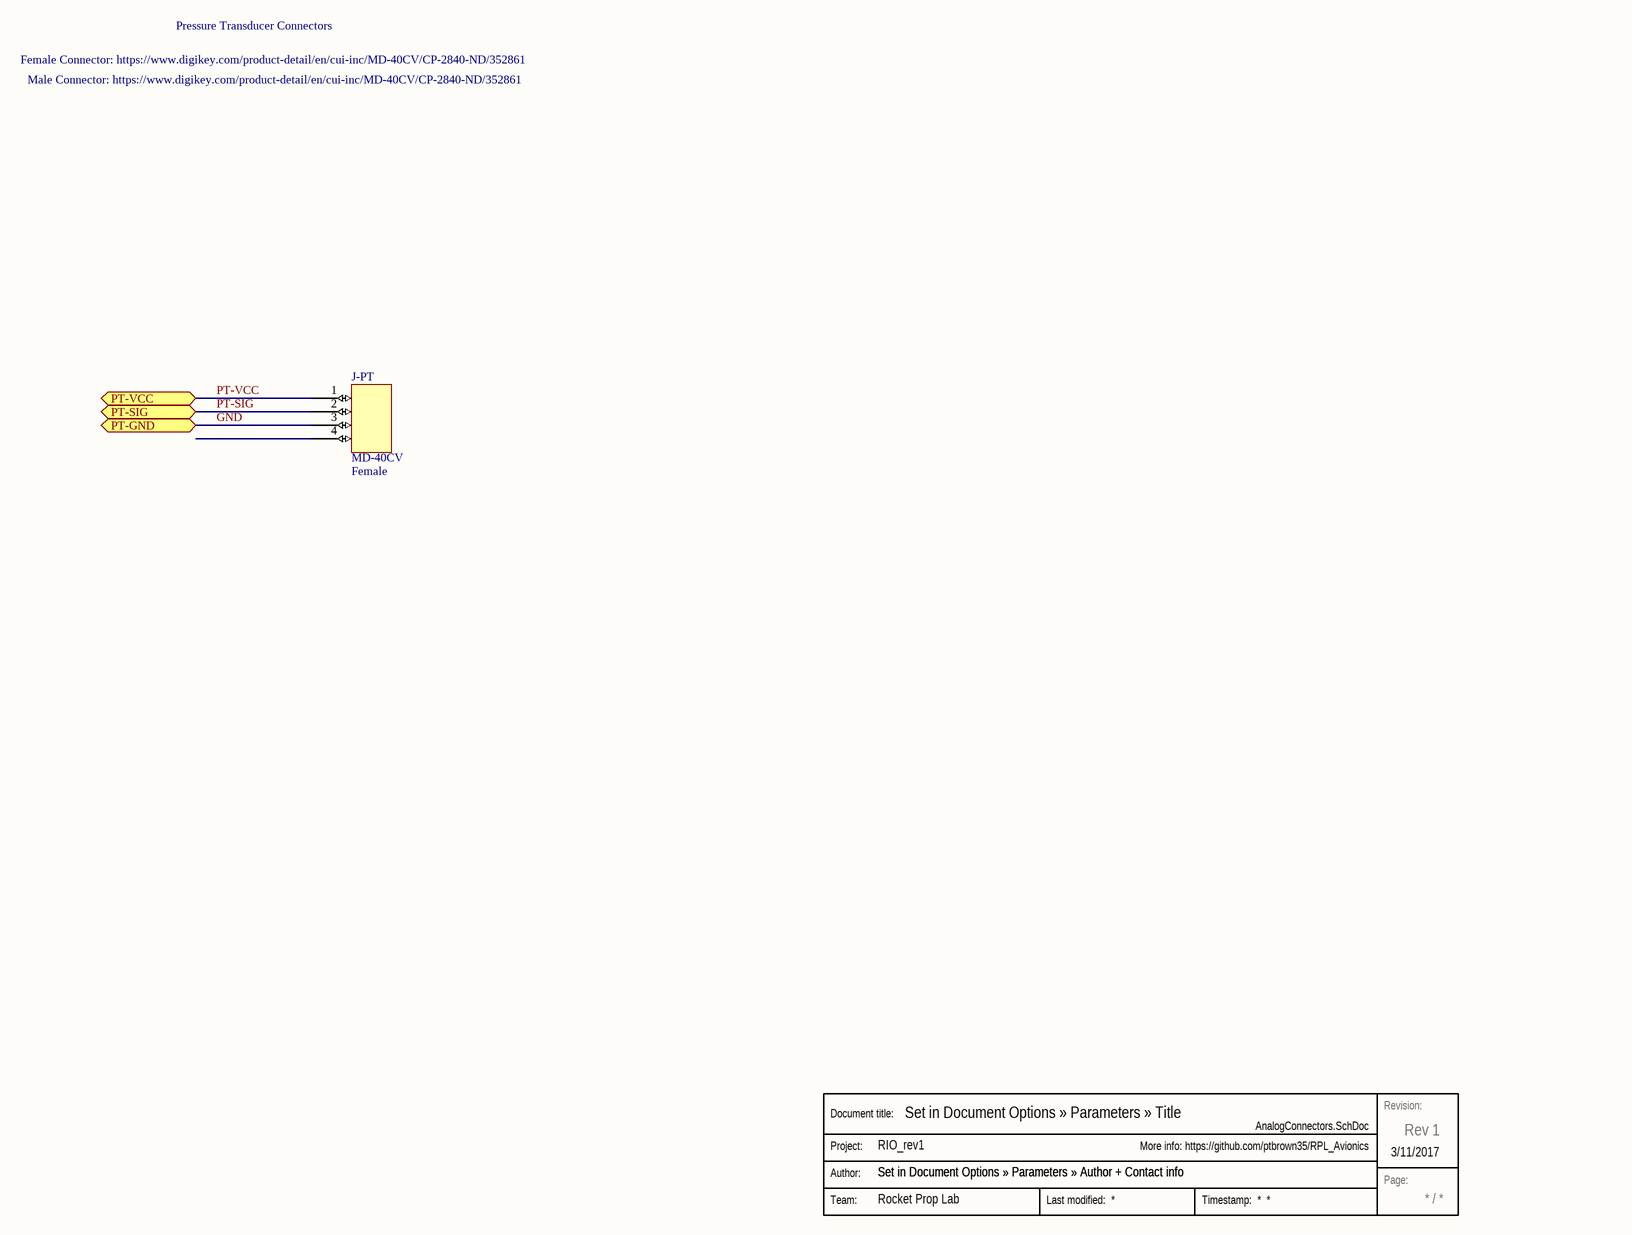
[diagram p4: AnalogConnectors.SchDoc]

### Parts
J-PT  Gender: Female  (hidden comment: MD-40CV)
Stamp  Stamp  (value not drawn)  (graphical)

### Ports
PT-GND, PT-SIG, PT-VCC

### Nets
GND: J-PT.3 ; port PT-GND
PT-SIG: J-PT.2 ; port PT-SIG
PT-VCC: J-PT.1 ; port PT-VCC

Not connected (* = marked no-connect by the designer): J-PT 4

### Channels
U_Connectors/J-PT1: designators end in _J-PT1; ports PT-GND=GND PT-SIG=PT-SIG PT-VCC=PT-VCC
U_Connectors/J-PT2: designators end in _J-PT2; ports PT-GND=GND PT-SIG=PT-SIG PT-VCC=PT-VCC
U_Connectors/J-PT3: designators end in _J-PT3; ports PT-GND=GND PT-SIG=PT-SIG PT-VCC=PT-VCC
U_Connectors/J-PT4: designators end in _J-PT4; ports PT-GND=GND PT-SIG=PT-SIG PT-VCC=PT-VCC
U_Connectors/J-PT5: designators end in _J-PT5; ports PT-GND=GND PT-SIG=PT-SIG PT-VCC=PT-VCC
U_Connectors/J-PT6: designators end in _J-PT6; ports PT-GND=GND PT-SIG=PT-SIG PT-VCC=PT-VCC
U_Connectors/J-PT7: designators end in _J-PT7; ports PT-GND=GND PT-SIG=PT-SIG PT-VCC=PT-VCC
U_Connectors/J-PT8: designators end in _J-PT8; ports PT-GND=GND PT-SIG=PT-SIG PT-VCC=PT-VCC

### Notes on the sheet
- Pressure Transducer Connectors
- Female Connector: https://www.digikey.com/product-detail/en/cui-inc/MD-40CV/CP-2840-ND/352861
- Male Connector: https://www.digikey.com/product-detail/en/cui-inc/MD-40CV/CP-2840-ND/352861
- (in symbol Stamp) Revision:; Document title:; Project:; Author:; Page:; Team:

### Library data of the parts
J-PT = MD-40CV: Manufacturer: CUI, Inc.; Digikey Link: https://www.digikey.com/product-detail/en/cui-inc/MD-40CV/CP-2840-ND/352861; Digikey P/N: CP-2840-ND; Manufacturer P/N: MD-40CV

## Sheet PowerManagement.SchDoc: Set in Document Options » Parameters » Title
size Tabloid; Author: Set in Document Options » Parameters » Author + Contact info
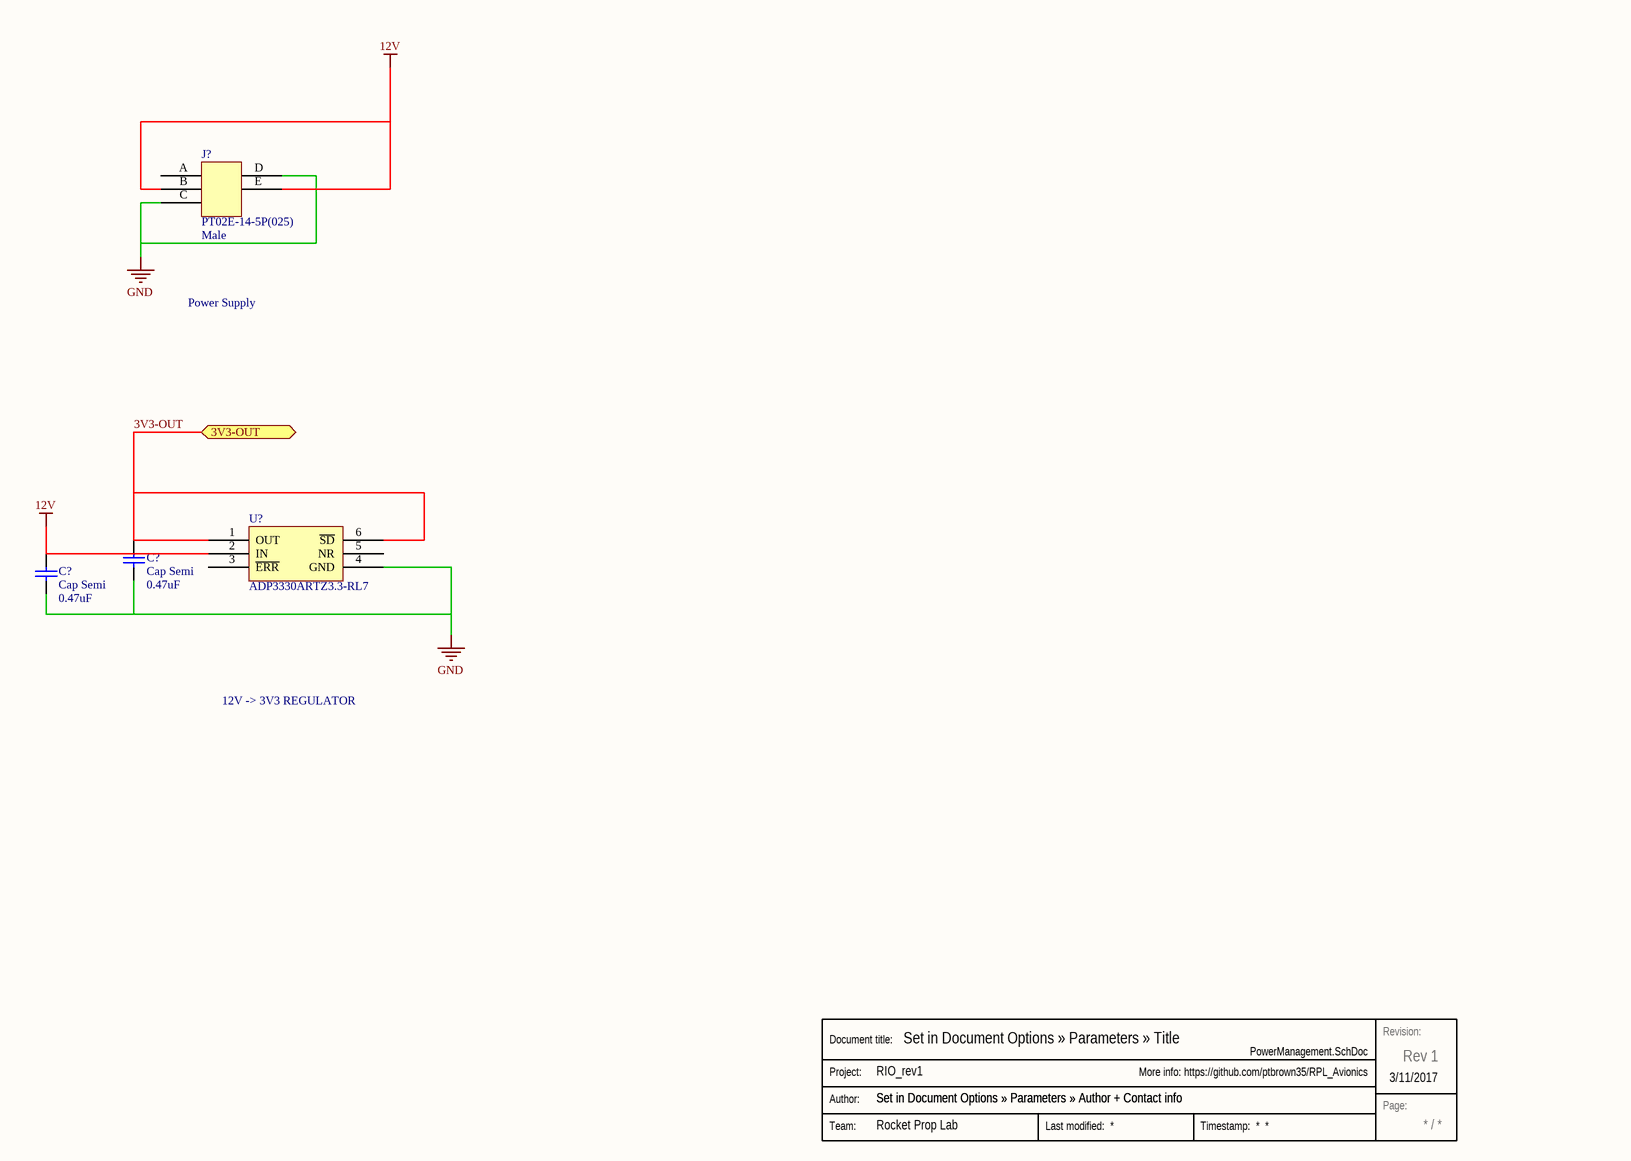
[diagram p5: PowerManagement.SchDoc]

### Parts
(Parts that share a designator on the sheet are numbered #1, #2 ... from top to bottom, then left to right.)
C?#14  Cap Semi  value 0.47uF  [0402]
C?#15  Cap Semi  value 0.47uF  [0402]
J?#2  Gender: Male  (hidden comment: PT02E-14-5P(025))
Stamp#5  Stamp  (value not drawn)  (graphical)
U?#3  ADP3330ARTZ3.3-RL7

### Ports
3V3-OUT

### Nets

Not connected (* = marked no-connect by the designer): C?#14 1 2; C?#15 1 2; J?#2 A B C D E; U?#3 1(OUT) 2(IN) 3(~{ERR}) 4(GND) 5(NR) 6(~{SD})

### Buses and harness runs
bus 3V3-OUT = port 3V3-OUT

### Notes on the sheet
- Power Supply
- 12V -> 3V3 REGULATOR
- Labels drawn without touching a wire or pin: 12V, GND
- (in symbol Stamp) Revision:; Document title:; Project:; Author:; Page:; Team:

### Library data of the parts
C?#14 C?#15 = Cap Semi: Capacitor (Semiconductor SIM Model); Published: 8-Jun-2000; LatestRevisionDate: 29-May-2009; LatestRevisionNote: IPC-7351 Footprint Added.; PackageReference: C1206; Publisher: Altium Limited; PackageDescription: Chip Capacitor
J?#2 = PT02E-14-5P(025): Manufacturer: Amphenol Industrial Operations; Digikey P/N: PT02E-14-5P(025)-ND; Digikey Link: https://www.digikey.com/product-detail/en/amphenol-industrial-operations/PT02E-14-5P(025)/PT02E-14-5P(025)-ND/1209810; Manufacturer P/N: PT02E-14-5P(025)
U?#3 = ADP3330ARTZ3.3-RL7: Manufacturer: Analog Devices; Digikey P/N: ADP3330ARTZ3.3-RL7DKR-ND; Digikey Link: https://www.digikey.com/product-detail/en/analog-devices-inc/ADP3330ARTZ3.3-RL7/ADP3330ARTZ3.3-RL7DKR-ND/1788602; Manufacturer P/N: ADP3330ARTZ3.3-RL7

## Sheet PTSignals.SchDoc: Set in Document Options » Parameters » Title
size Tabloid; Author: Set in Document Options » Parameters » Author + Contact info
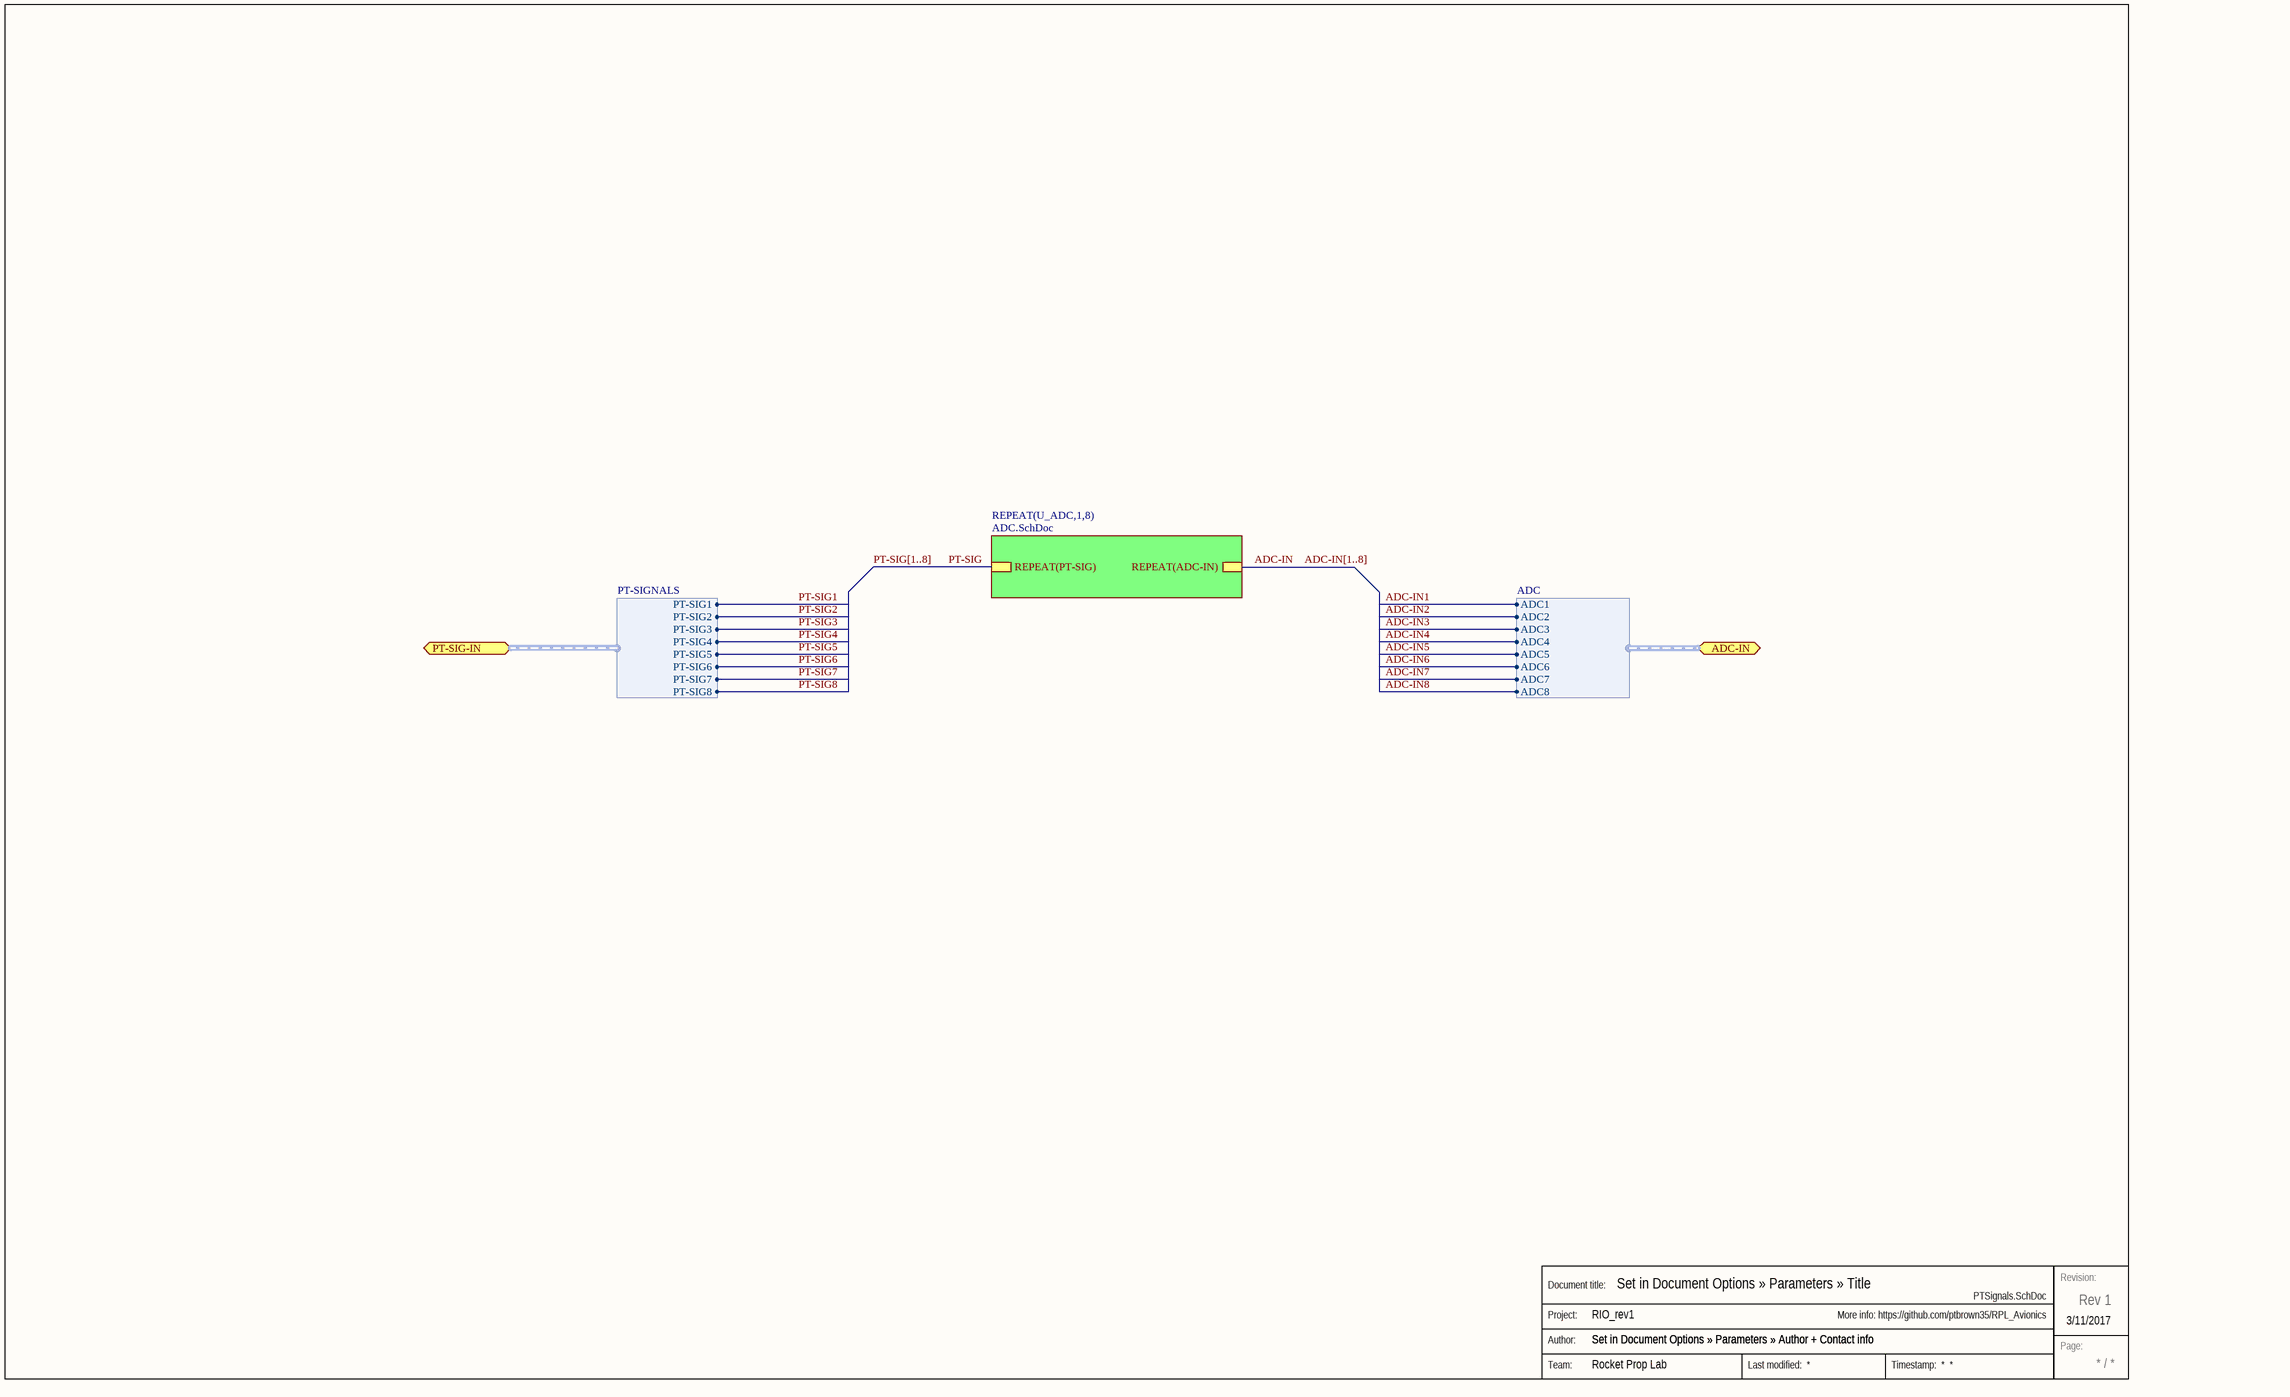
[diagram p6: PTSignals.SchDoc]

### Parts
(Parts that share a designator on the sheet are numbered #1, #2 ... from top to bottom, then left to right.)
Stamp#6  Stamp  (value not drawn)  (graphical)

### Sub-sheets
REPEAT(U_ADC,1,8) = ADC.SchDoc (file not in this document): REPEAT(PT-SIG), REPEAT(ADC-IN)

### Ports
ADC-IN (harness ADC), PT-SIG-IN (harness PT-SIGNALS)

### Harnesses
ADC: ADC1, ADC2, ADC3, ADC4, ADC5, ADC6, ADC7, ADC8
PT-SIGNALS: PT-SIG1, PT-SIG2, PT-SIG3, PT-SIG4, PT-SIG5, PT-SIG6, PT-SIG7, PT-SIG8

### Buses and harness runs
bus ADC-IN[1..8]
bus PT-SIG[1..8]

### Notes on the sheet
- (in symbol Stamp) Revision:; Document title:; Project:; Author:; Page:; Team:

## Sheet ThermocoupleCircuit.SchDoc: Set in Document Options » Parameters » Title
size Tabloid; Author: Set in Document Options » Parameters » Author + Contact info
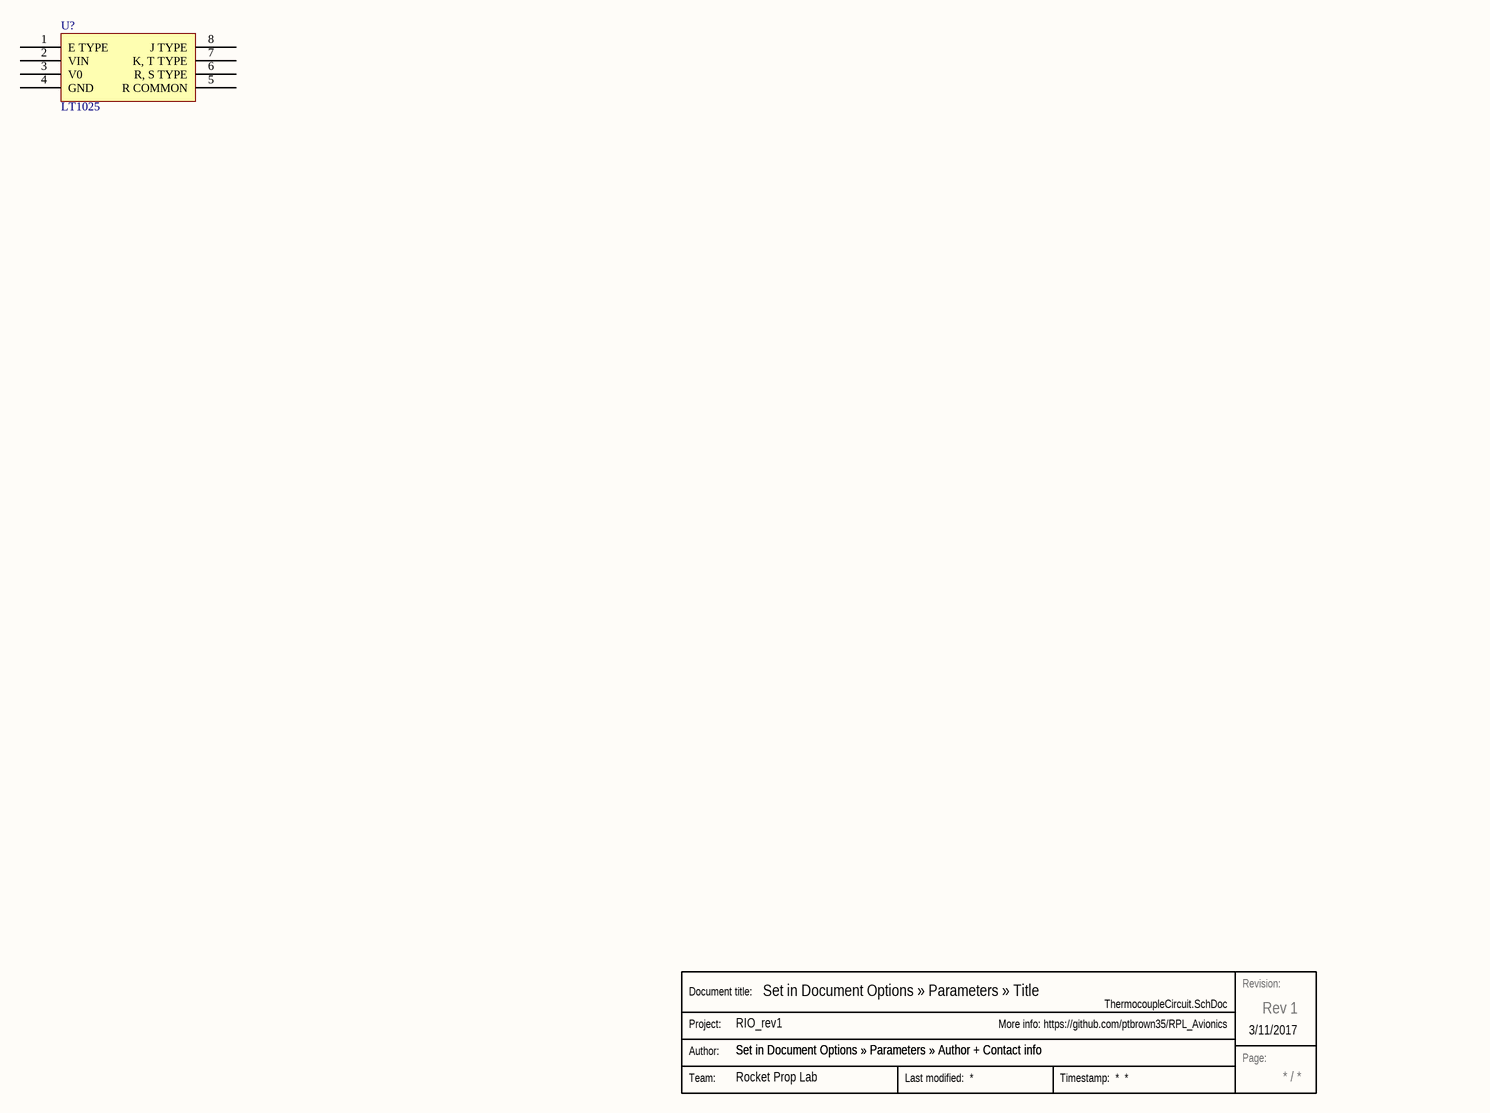
[diagram p7: ThermocoupleCircuit.SchDoc]

### Parts
(Parts that share a designator on the sheet are numbered #1, #2 ... from top to bottom, then left to right.)
Stamp#7  Stamp  (value not drawn)  (graphical)
U?#4  LT1025

### Nets

Not connected (* = marked no-connect by the designer): U?#4 1(E_TYPE) 2(VIN) 3(V0) 4(GND) 5(R_COMMON) 6(R,_S_TYPE) 7(K,_T_TYPE) 8(J_TYPE)

### Notes on the sheet
- (in symbol Stamp) Revision:; Document title:; Project:; Author:; Page:; Team:

### Library data of the parts
U?#4 = LT1025: Manufacturer: Linear Technology; Digikey P/N: LT1025CS8#PBF-ND; Digikey Link: https://www.digikey.com/product-detail/en/LT1025CS8%23PBF/LT1025CS8%23PBF-ND/962708; Footprint: 8-SOIC; Manufacturer P/N: LT1025

## Sheet Actuator.SchDoc: Set in Document Options » Parameters » Title
size Tabloid; Author: Set in Document Options » Parameters » Author + Contact info
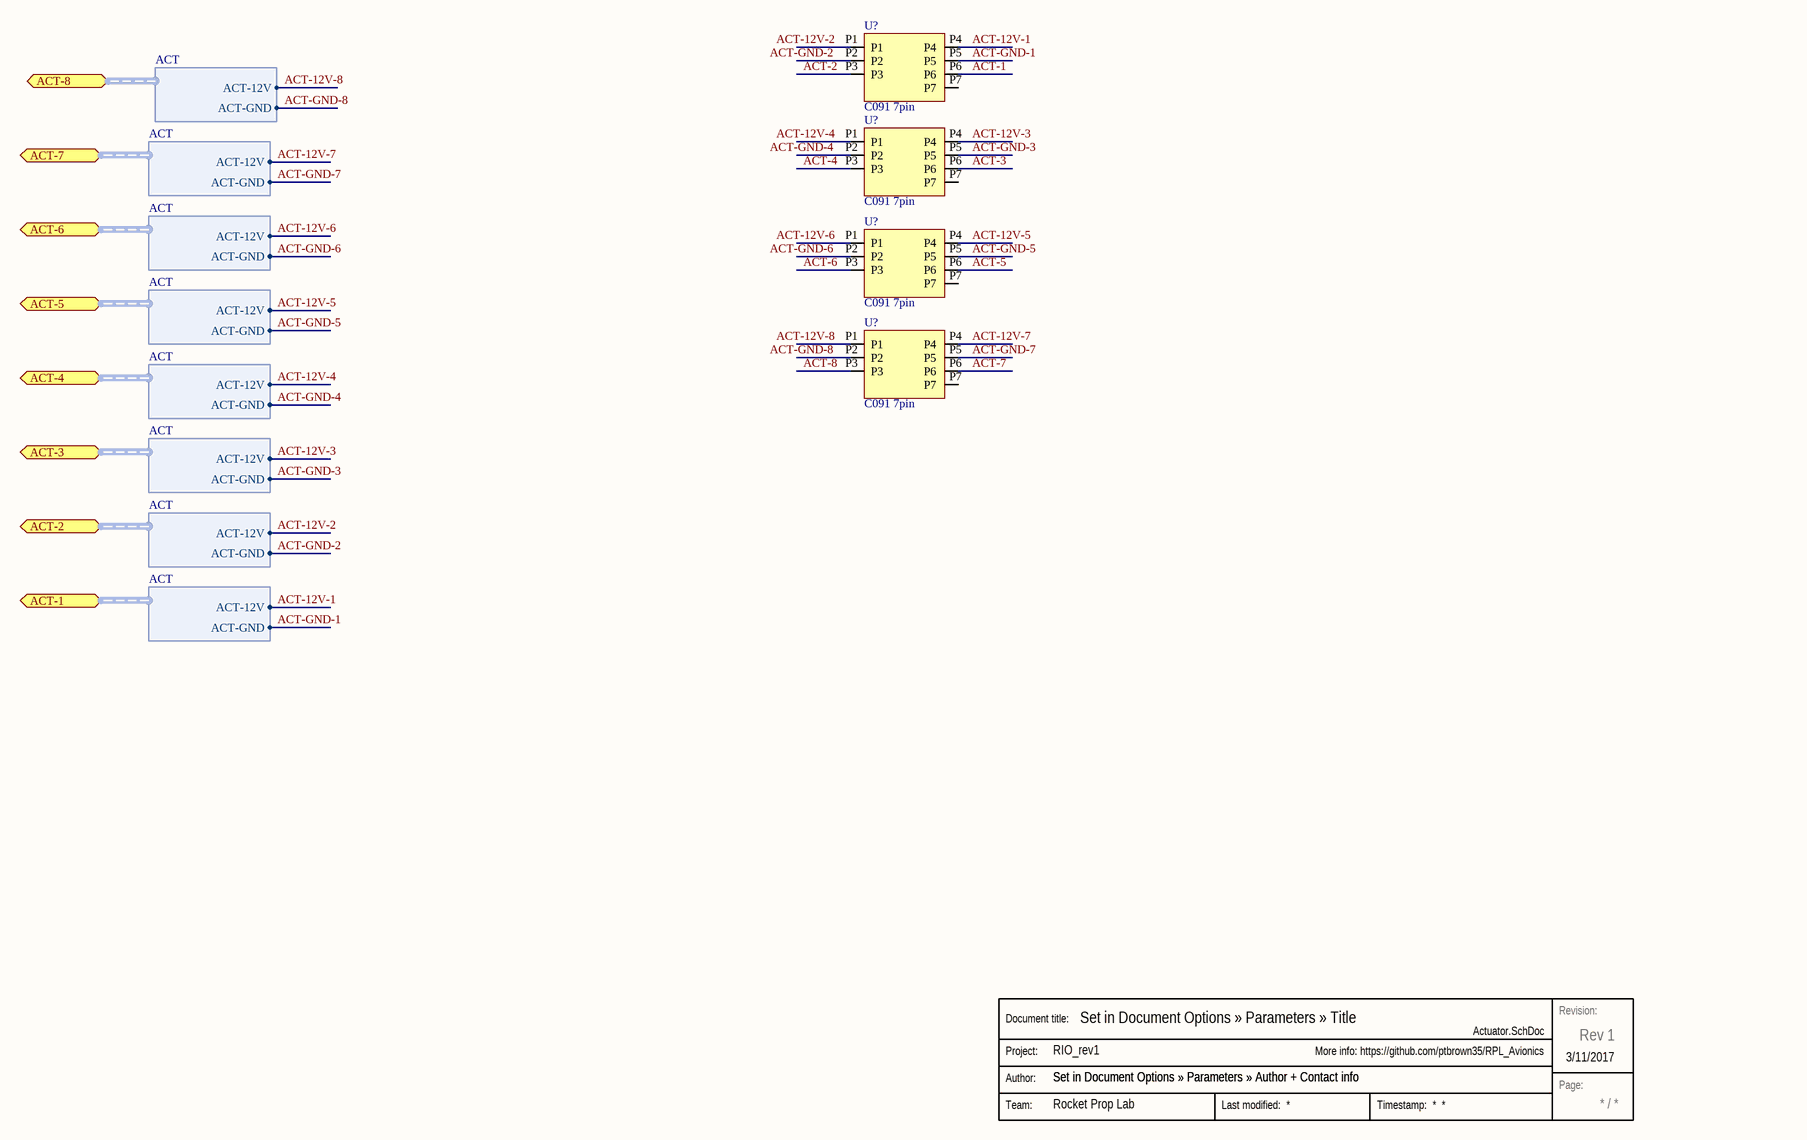
[diagram p8: Actuator.SchDoc]

### Parts
(Parts that share a designator on the sheet are numbered #1, #2 ... from top to bottom, then left to right.)
Stamp#8  Stamp  (value not drawn)  (graphical)
U?#5  C091 7pin
U?#6  C091 7pin
U?#7  C091 7pin
U?#8  C091 7pin

### Ports
ACT-1 (harness ACT), ACT-2 (harness ACT), ACT-3 (harness ACT), ACT-4 (harness ACT), ACT-5 (harness ACT), ACT-6 (harness ACT), ACT-7 (harness ACT), ACT-8 (harness ACT)

### Harnesses
ACT: ACT-GND, ACT-12V

### Nets
ACT-1: U?#5.P6
ACT-2: U?#5.P3
ACT-3: U?#6.P6
ACT-4: U?#6.P3
ACT-5: U?#7.P6
ACT-6: U?#7.P3
ACT-7: U?#8.P6
ACT-8: U?#8.P3
ACT-12V-1: U?#5.P4 ; port ACT-1.ACT-12V
ACT-12V-2: port ACT-2.ACT-12V
ACT-12V-3: U?#6.P4 ; port ACT-3.ACT-12V
ACT-12V-4: port ACT-4.ACT-12V
ACT-12V-5: U?#7.P4 ; port ACT-5.ACT-12V
ACT-12V-6: port ACT-6.ACT-12V
ACT-12V-7: U?#8.P4 ; port ACT-7.ACT-12V
ACT-12V-8: port ACT-8.ACT-12V
ACT-GND-1: U?#5.P5 ; port ACT-1.ACT-GND
ACT-GND-2: port ACT-2.ACT-GND
ACT-GND-3: U?#6.P5 ; port ACT-3.ACT-GND
ACT-GND-4: port ACT-4.ACT-GND
ACT-GND-5: U?#7.P5 ; port ACT-5.ACT-GND
ACT-GND-6: port ACT-6.ACT-GND
ACT-GND-7: U?#8.P5 ; port ACT-7.ACT-GND
ACT-GND-8: port ACT-8.ACT-GND

Not connected (* = marked no-connect by the designer): U?#5 P1 P2 P7; U?#6 P1 P2 P7; U?#7 P1 P2 P7; U?#8 P1 P2 P7

### Notes on the sheet
- Labels drawn without touching a wire or pin: ACT-12V-2, ACT-12V-4, ACT-12V-6, ACT-12V-8, ACT-GND-2, ACT-GND-4, ACT-GND-6, ACT-GND-8
- (in symbol Stamp) Revision:; Document title:; Project:; Author:; Page:; Team:

### Library data of the parts
U?#5-U?#8 = 7 pin connector

## Nets that join several sheets
GND: Ethernet (U?#2.33), U_Connectors/J-PT1 (J-PT_J-PT1.3), U_Connectors/J-PT2 (J-PT_J-PT2.3), U_Connectors/J-PT3 (J-PT_J-PT3.3), U_Connectors/J-PT4 (J-PT_J-PT4.3), U_Connectors/J-PT5 (J-PT_J-PT5.3), U_Connectors/J-PT6 (J-PT_J-PT6.3), U_Connectors/J-PT7 (J-PT_J-PT7.3), U_Connectors/J-PT8 (J-PT_J-PT8.3)
PT-VCC: Ethernet (R?#27.1), U_Connectors/J-PT1 (J-PT_J-PT1.1), U_Connectors/J-PT2 (J-PT_J-PT2.1), U_Connectors/J-PT3 (J-PT_J-PT3.1), U_Connectors/J-PT4 (J-PT_J-PT4.1), U_Connectors/J-PT5 (J-PT_J-PT5.1), U_Connectors/J-PT6 (J-PT_J-PT6.1), U_Connectors/J-PT7 (J-PT_J-PT7.1), U_Connectors/J-PT8 (J-PT_J-PT8.1)
PT-SIG: U_Connectors/J-PT1 (J-PT_J-PT1.2), U_Connectors/J-PT2 (J-PT_J-PT2.2), U_Connectors/J-PT3 (J-PT_J-PT3.2), U_Connectors/J-PT4 (J-PT_J-PT4.2), U_Connectors/J-PT5 (J-PT_J-PT5.2), U_Connectors/J-PT6 (J-PT_J-PT6.2), U_Connectors/J-PT7 (J-PT_J-PT7.2), U_Connectors/J-PT8 (J-PT_J-PT8.2)